# EAGLE schematic ver5b (EAGLE 6.4)
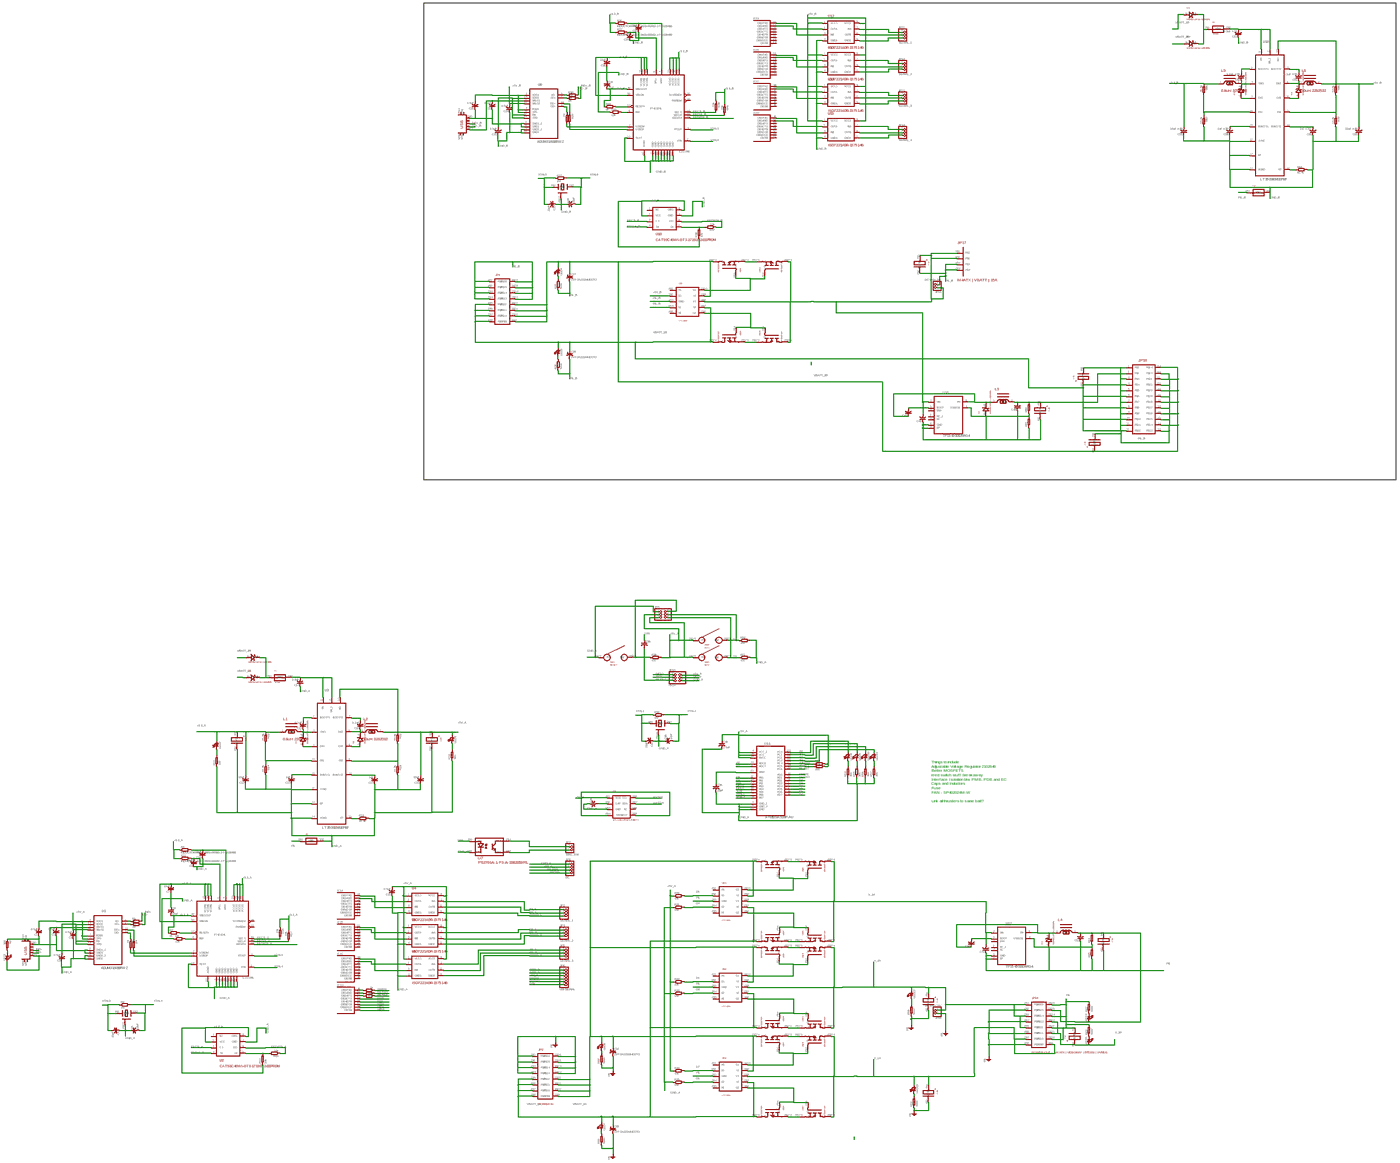
[diagram p0: schematic, sheet 1, overview]
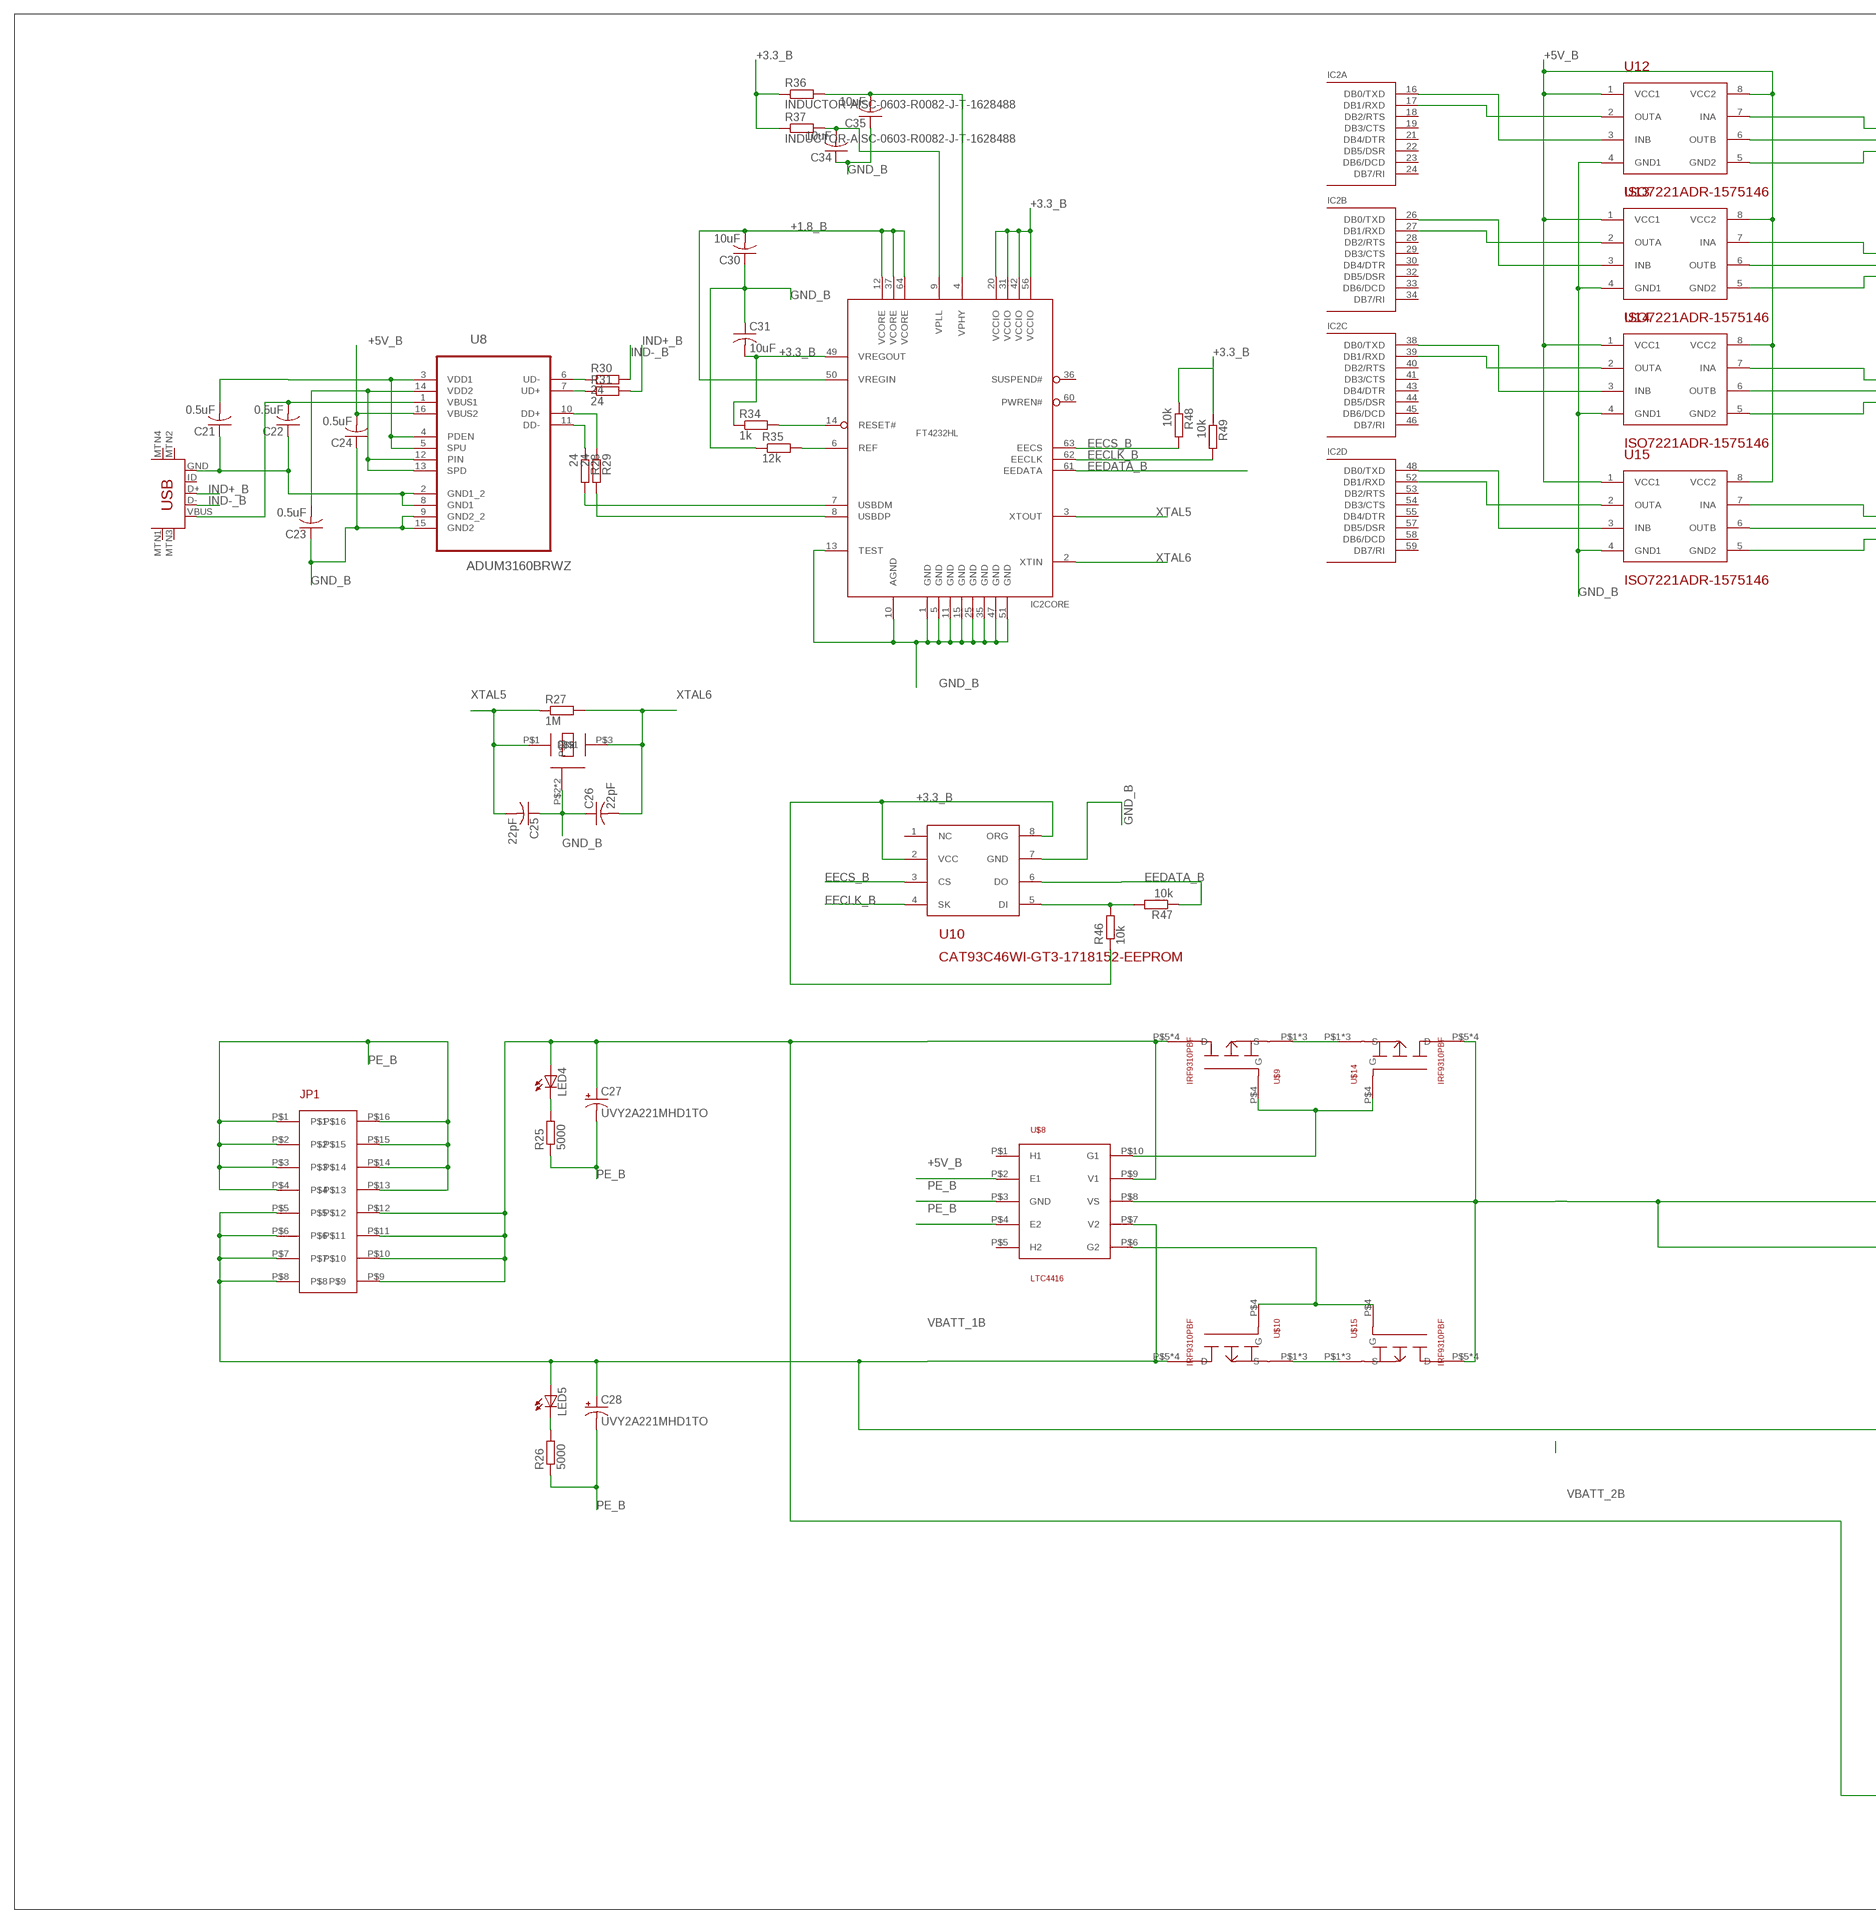
[diagram p1: schematic, sheet 1, part 1 of 6]
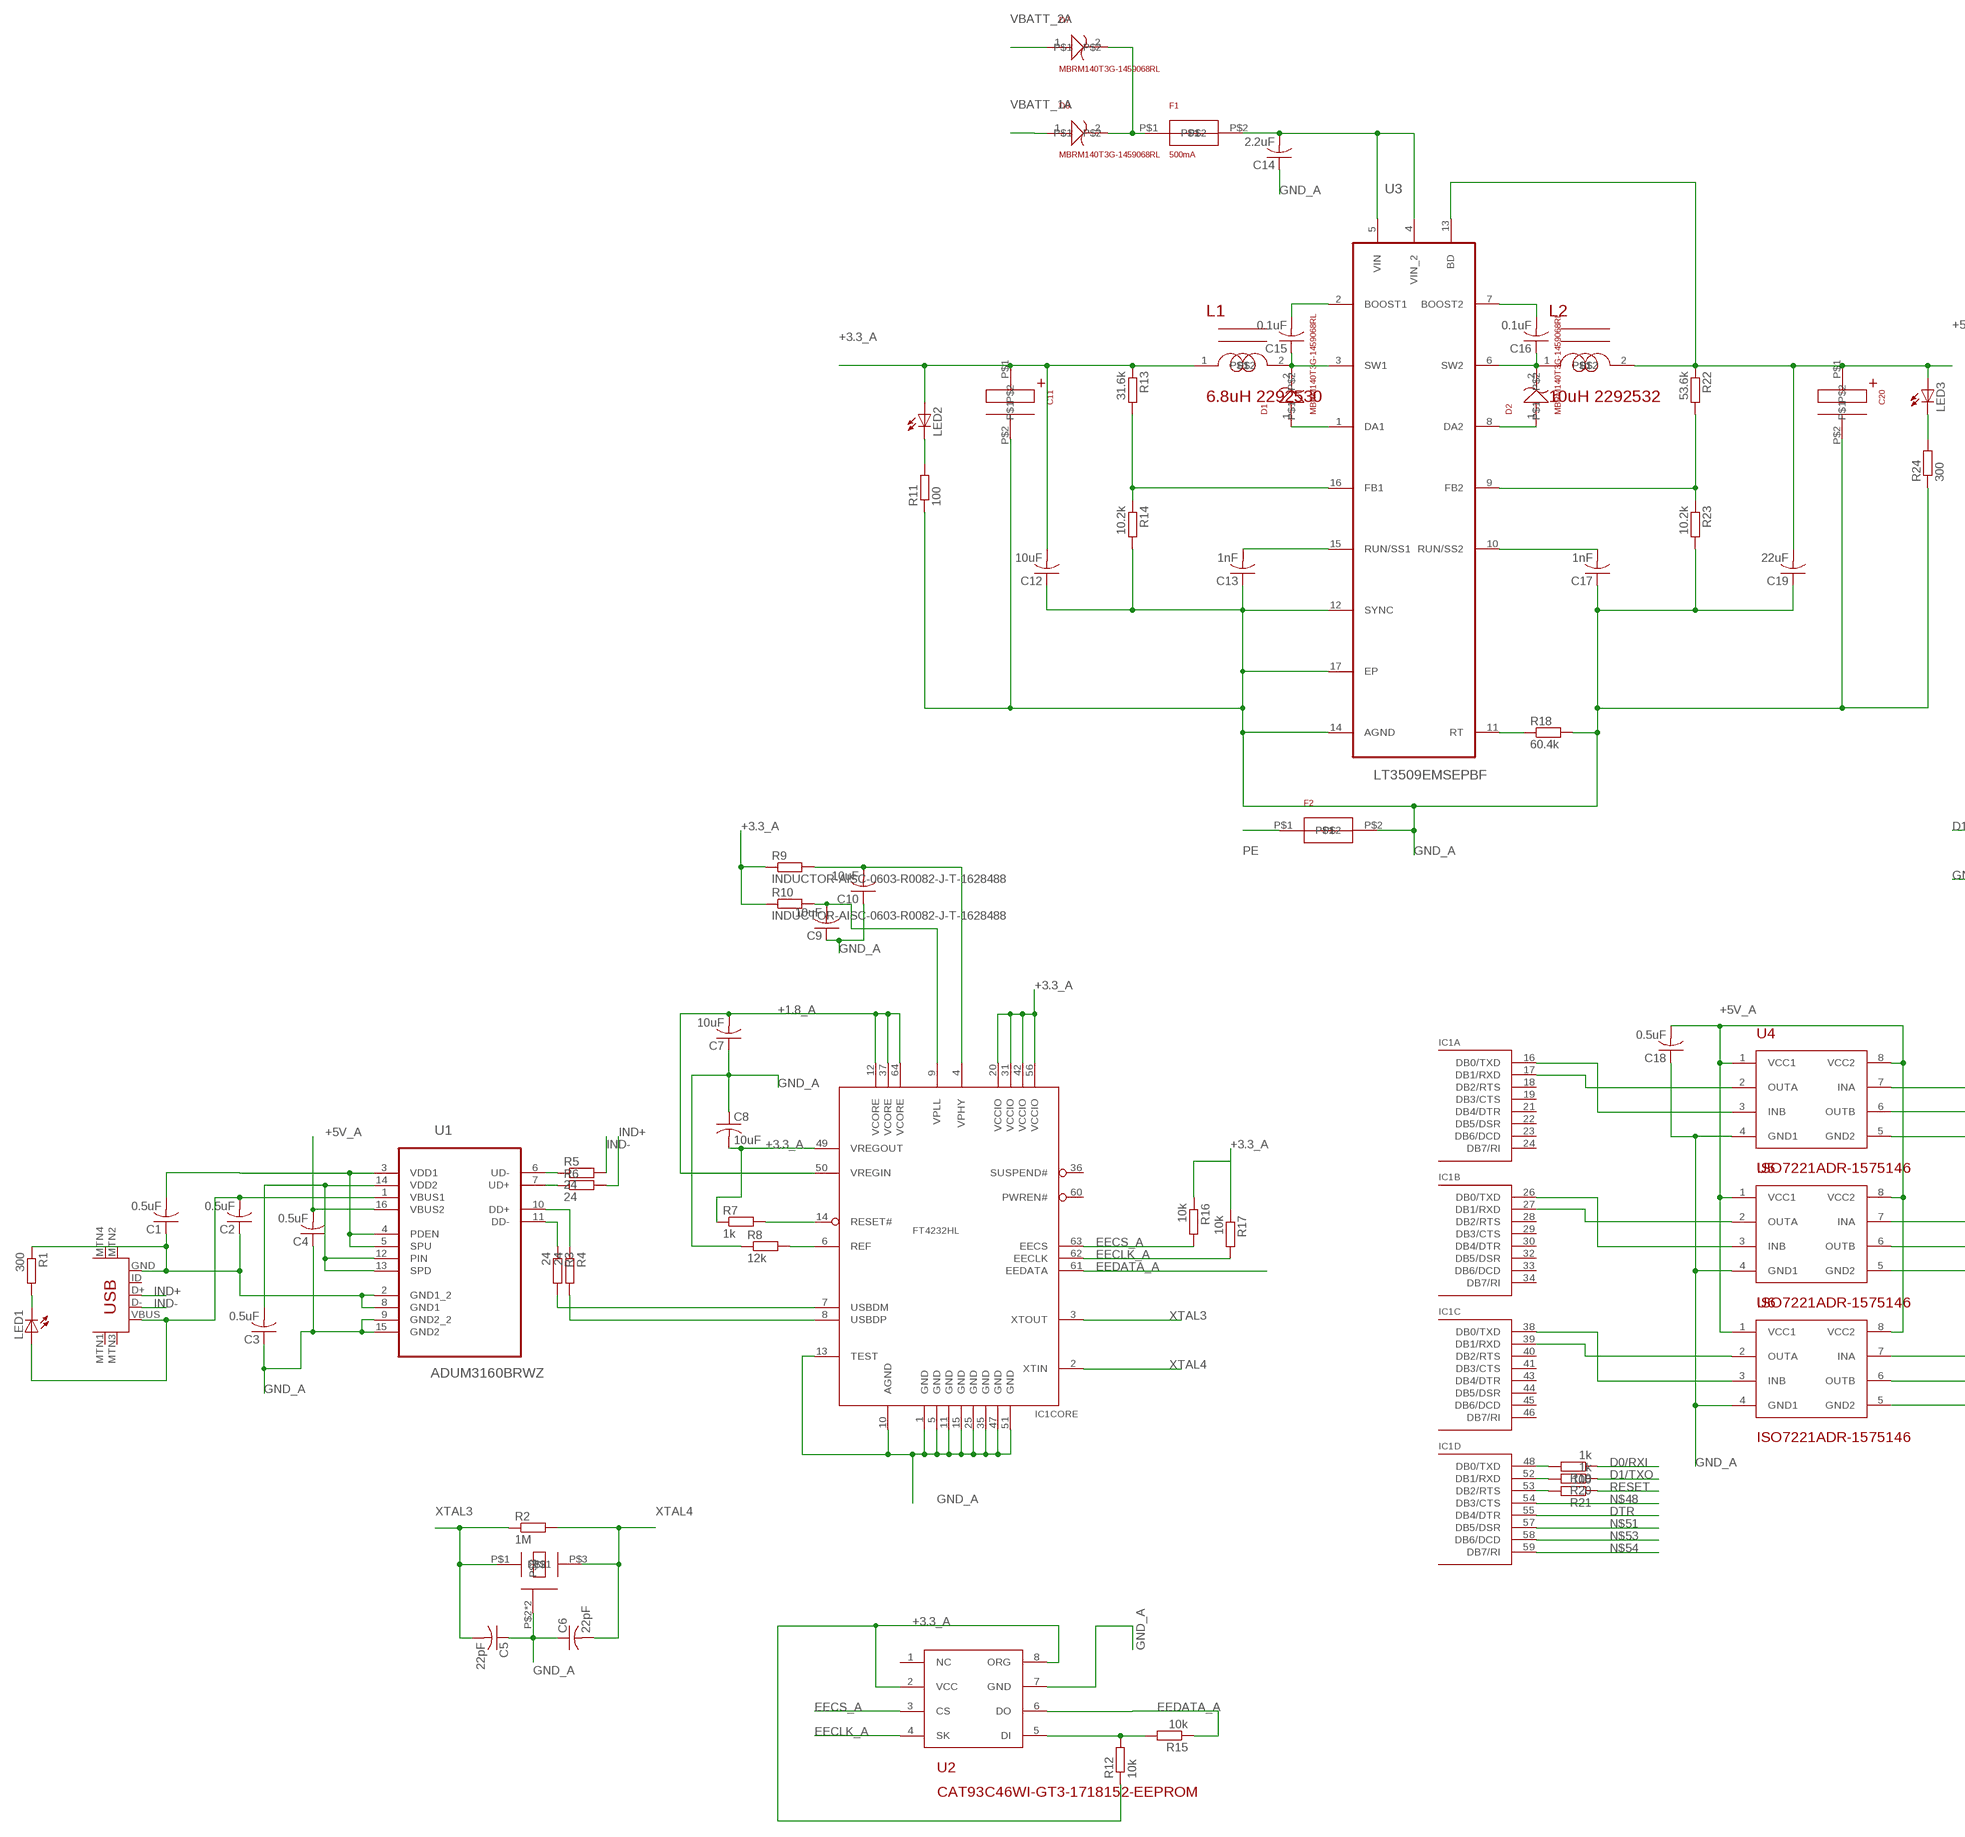
[diagram p2: schematic, sheet 1, part 2 of 6]
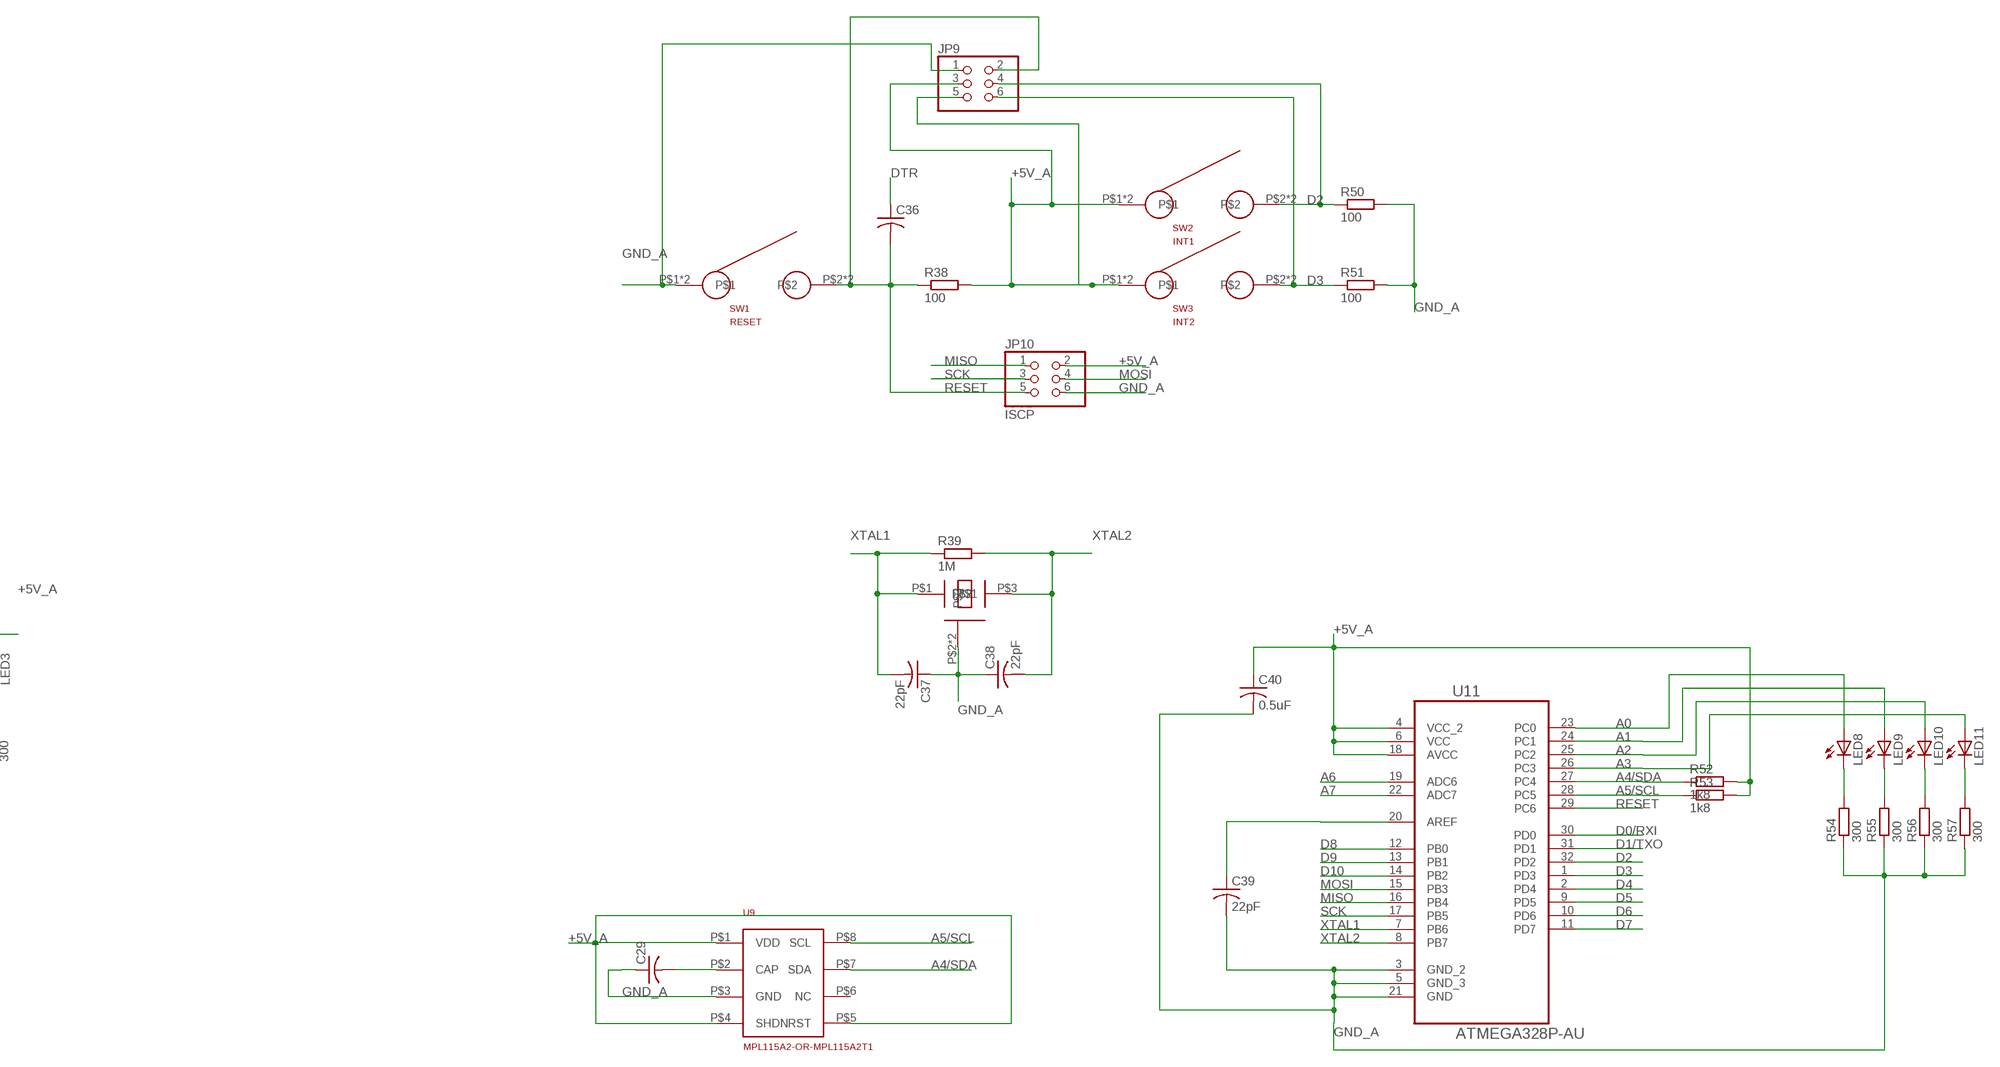
[diagram p3: schematic, sheet 1, part 3 of 6]
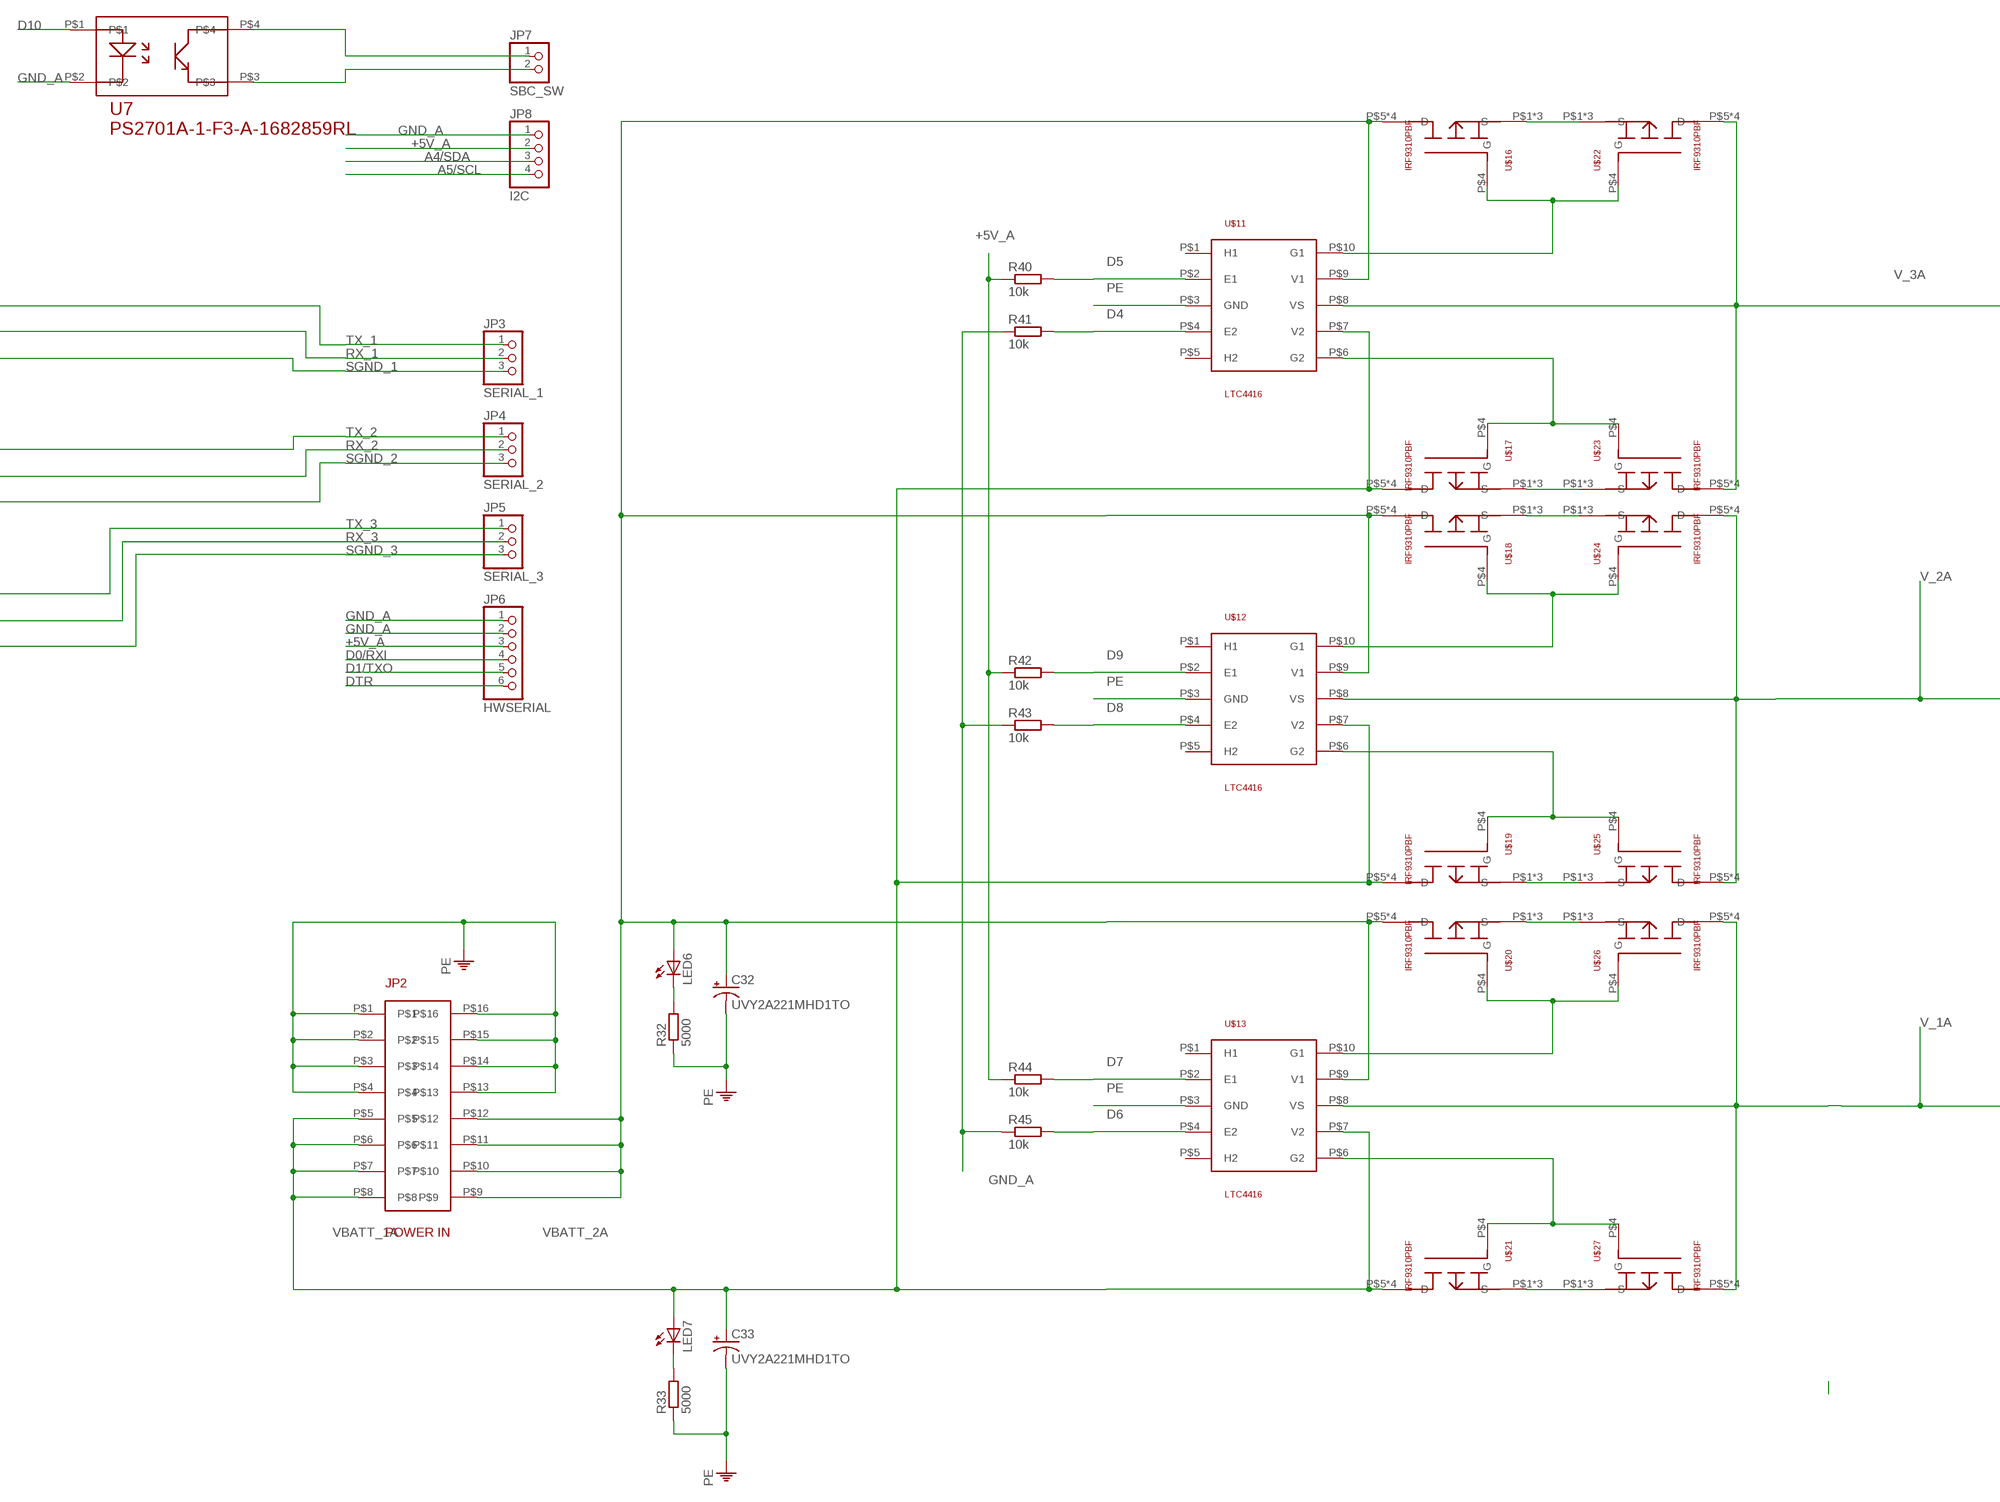
[diagram p4: schematic, sheet 1, part 4 of 6]
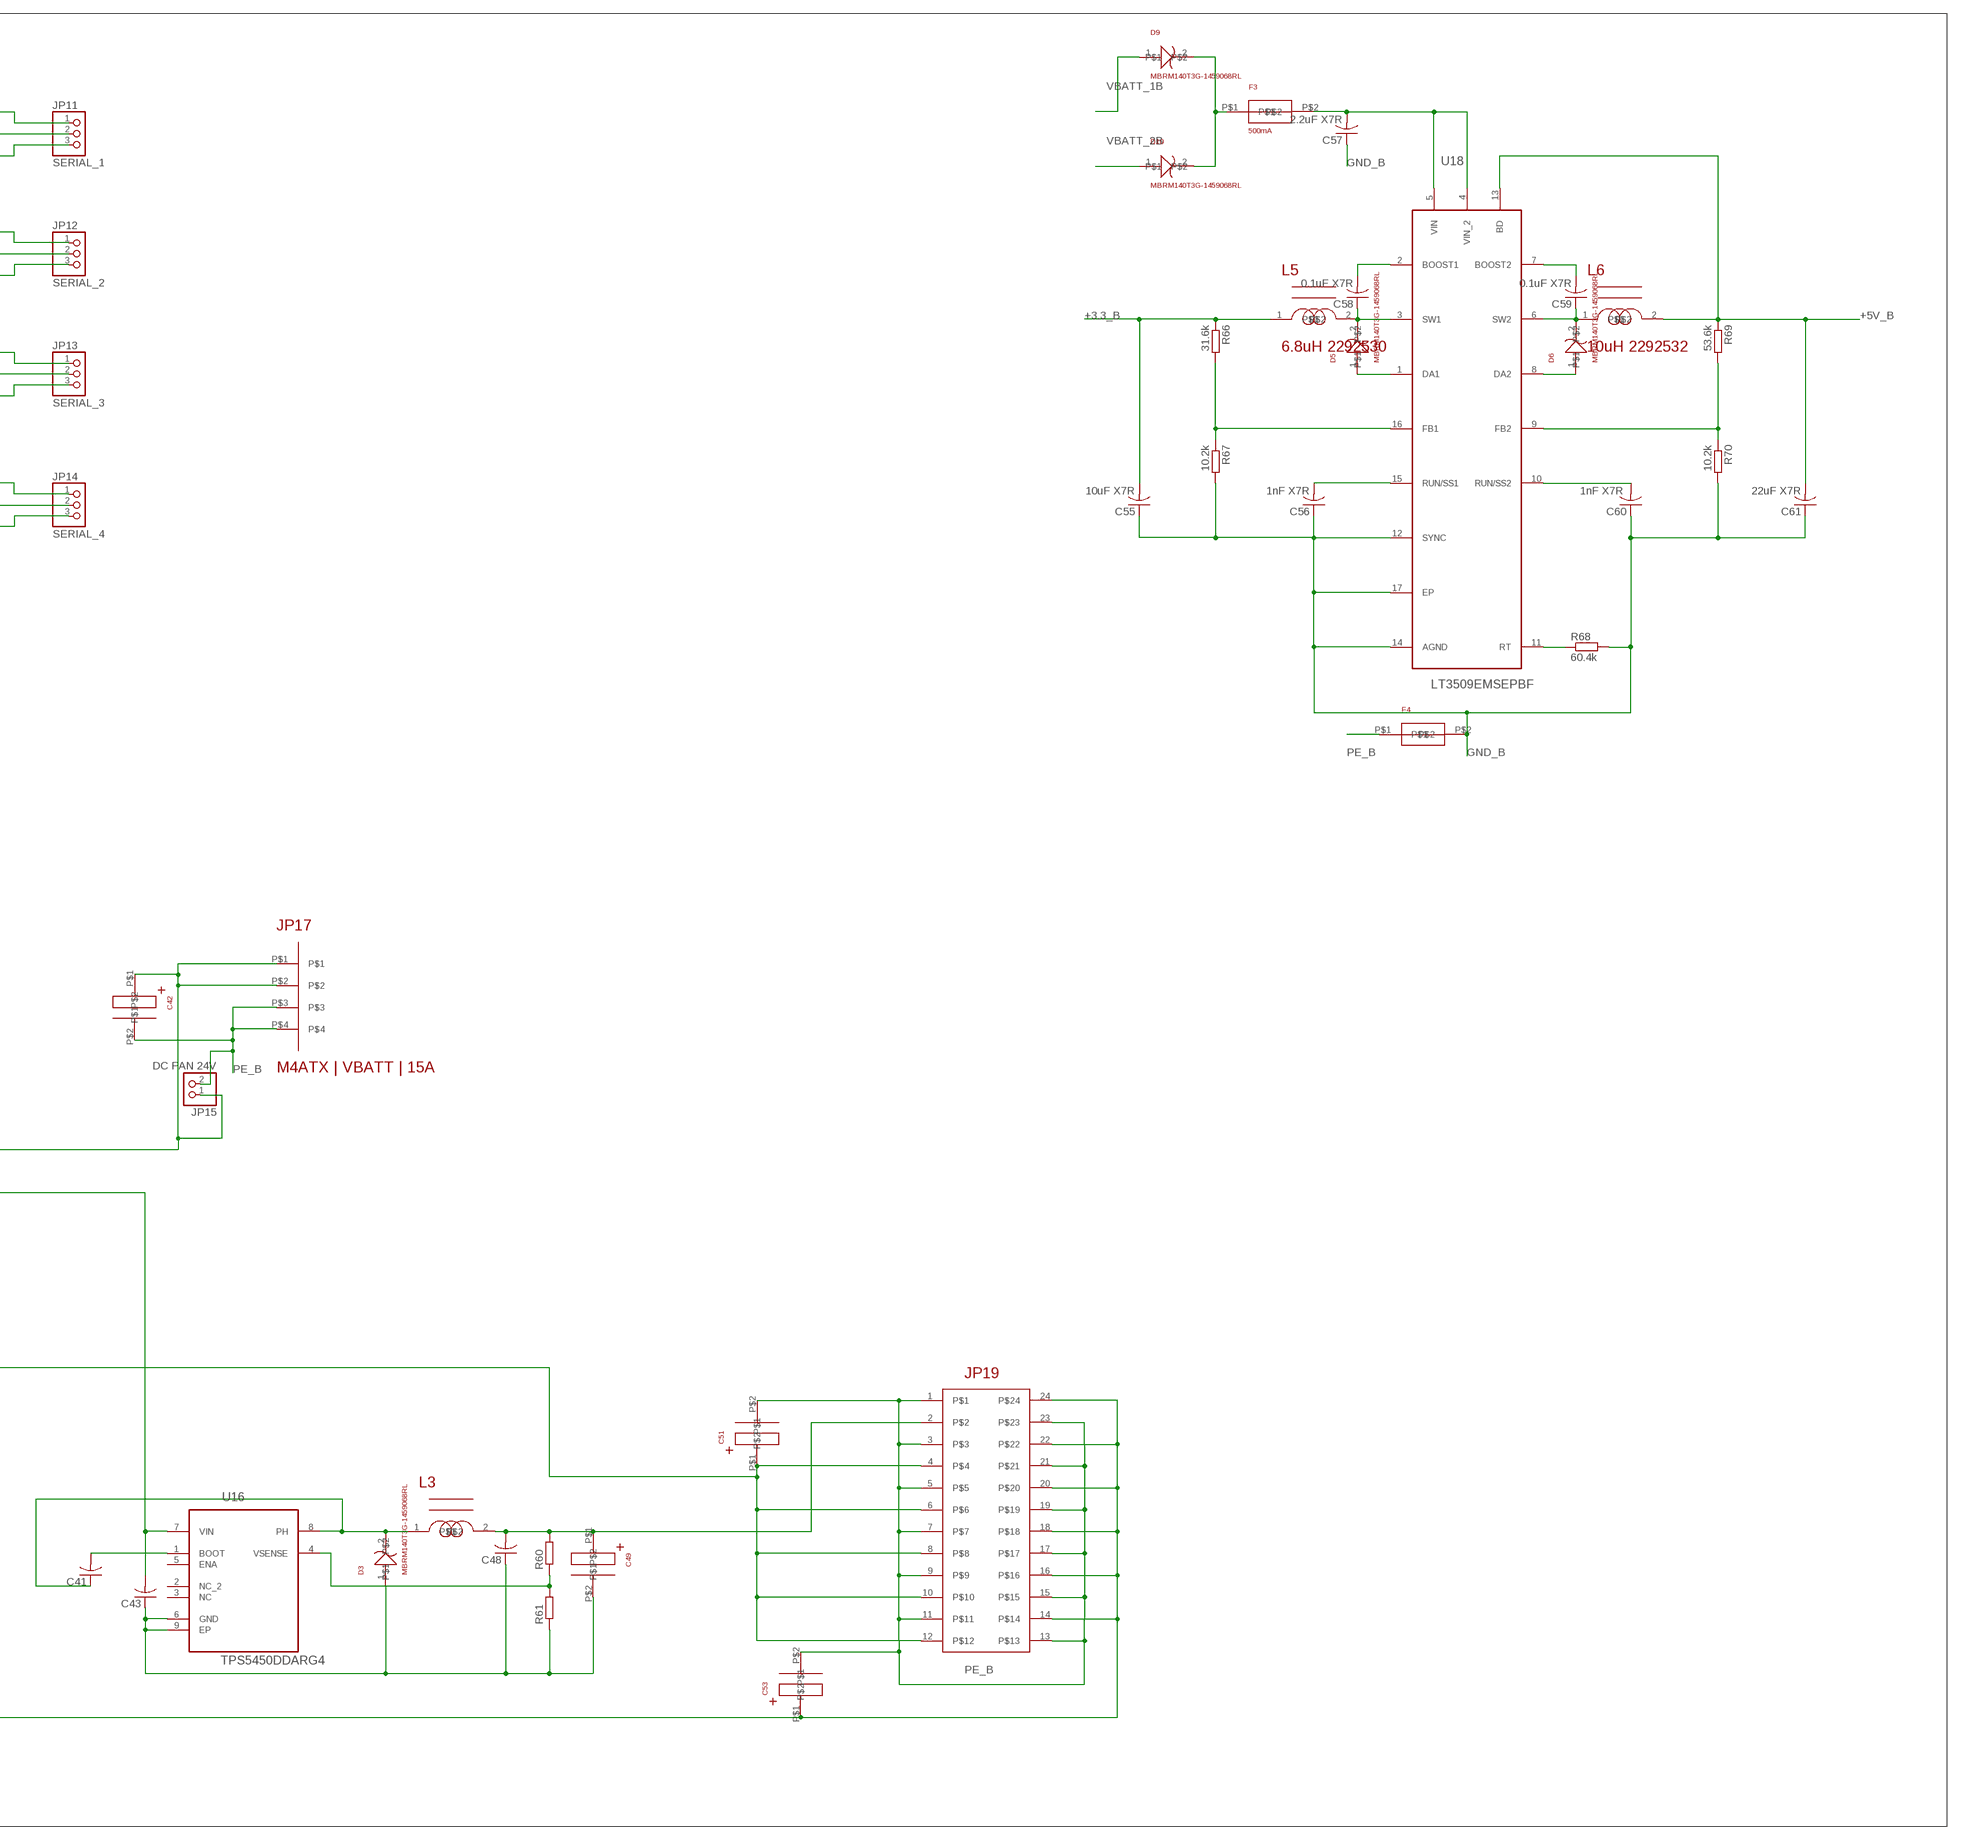
[diagram p5: schematic, sheet 1, part 5 of 6]
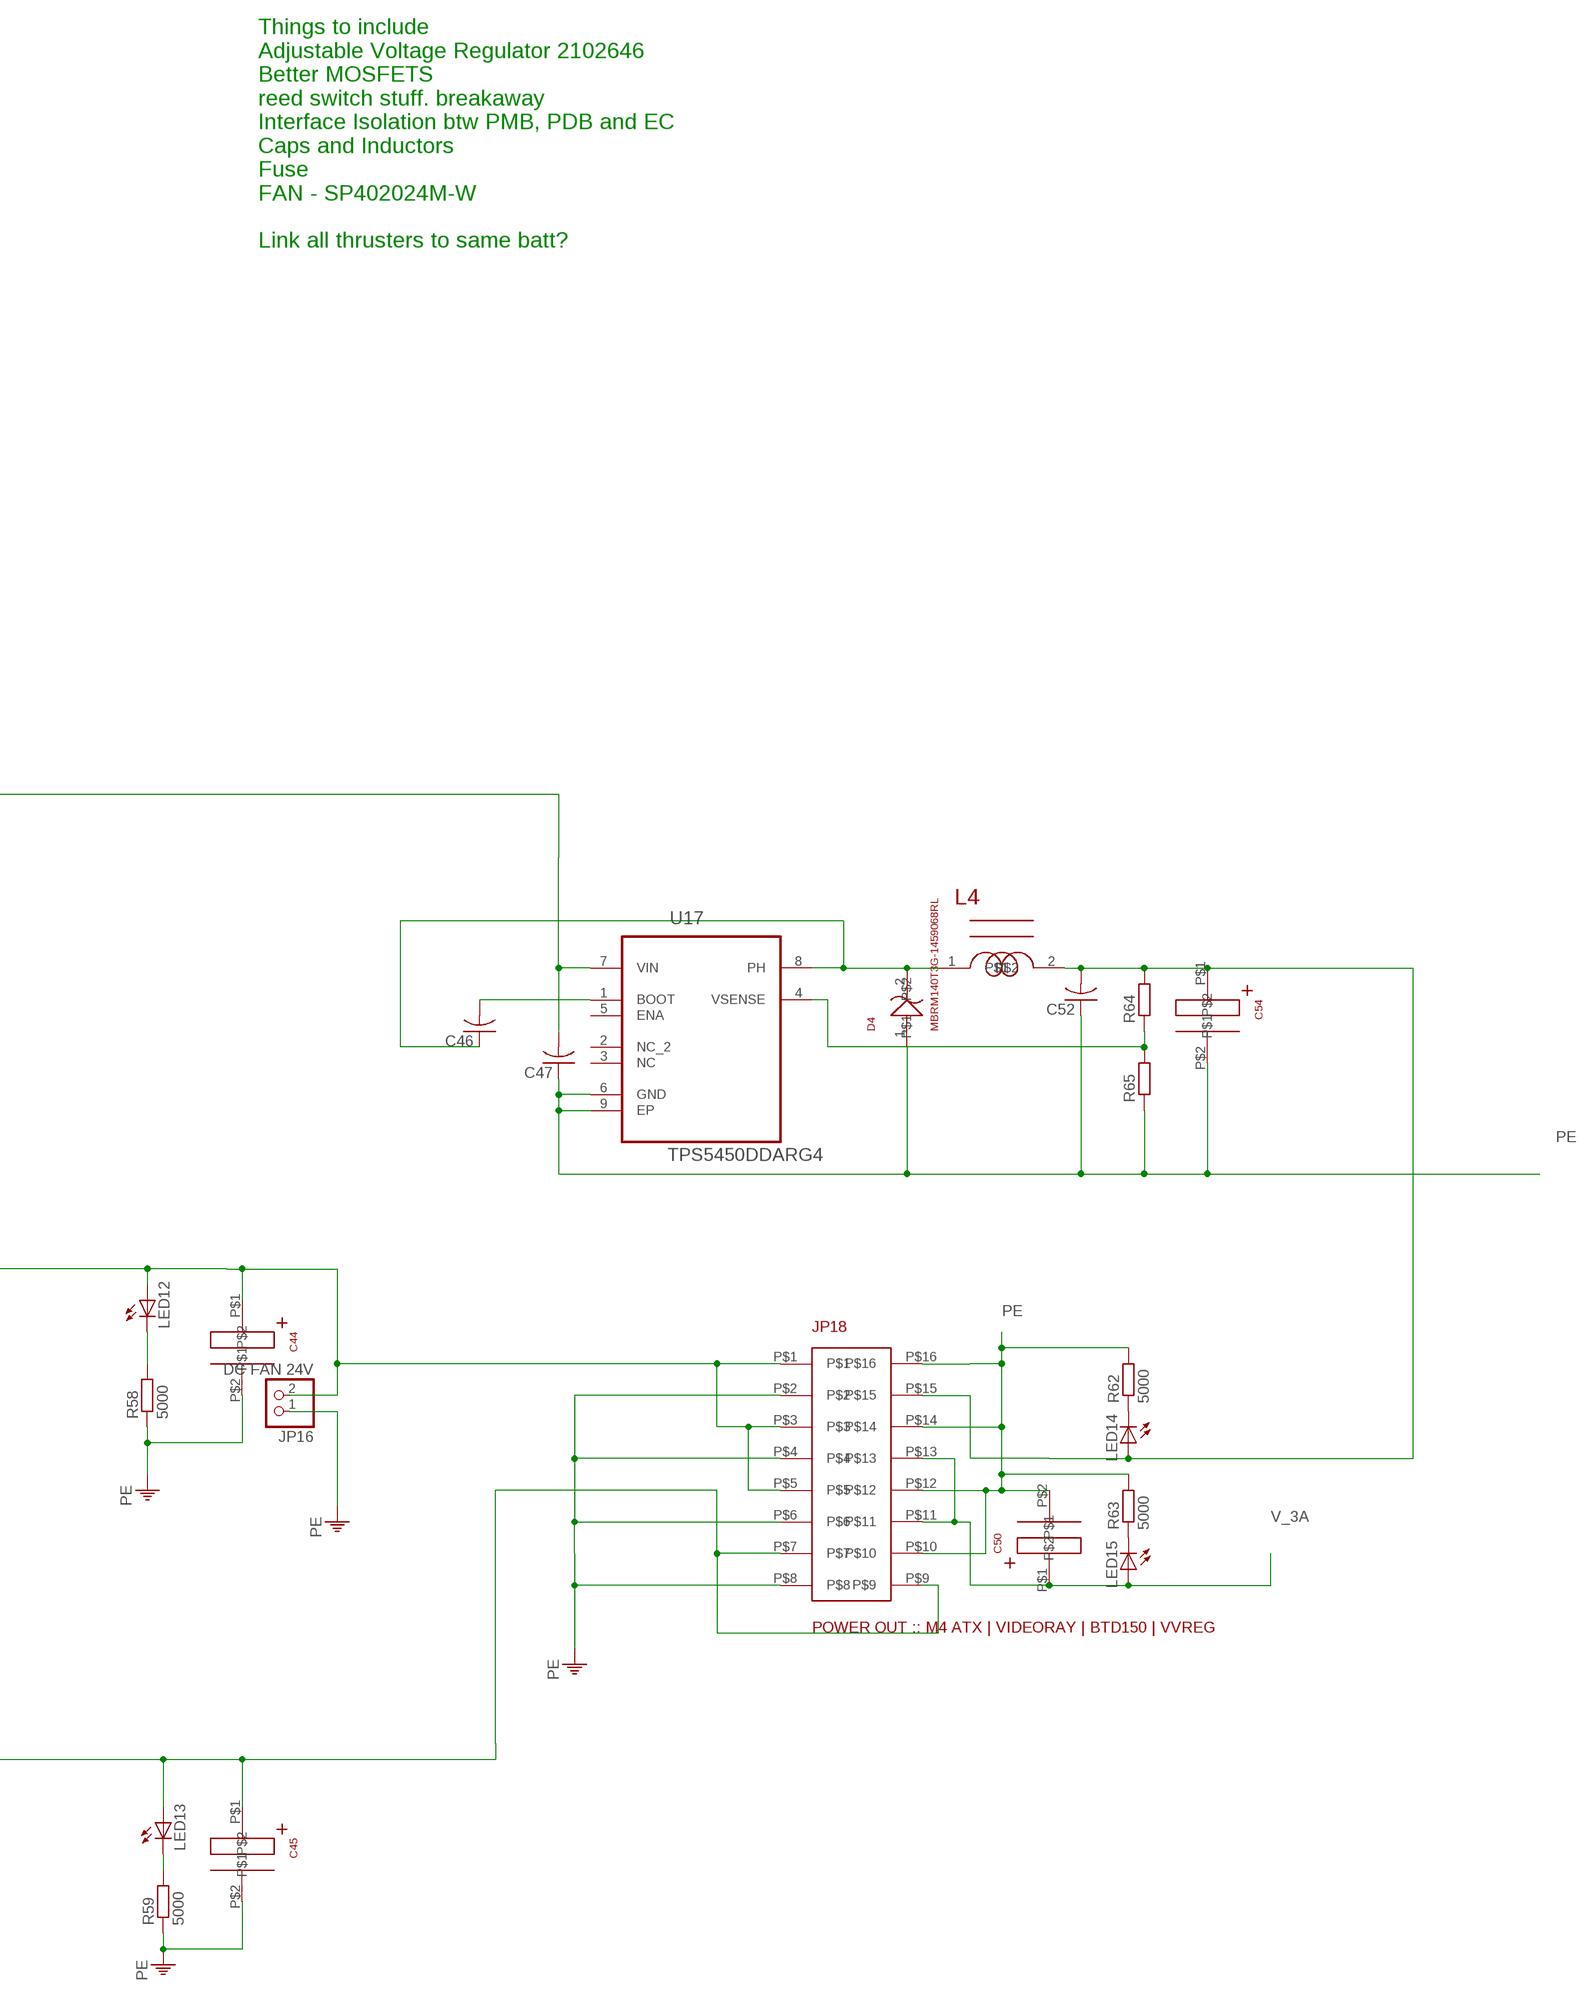
[diagram p6: schematic, sheet 1, part 6 of 6]

## Parts
C1  0.5uF  C-USC1206  [C1206]
C2  0.5uF  C-USC1206  [C1206]
C3  0.5uF  C-USC1206  [C1206]
C4  0.5uF  C-USC1206  [C1206]
C5  22pF  C-USC1206  [C1206]
C6  22pF  C-USC1206  [C1206]
C7  10uF  C-USC1206  [C1206]
C8  10uF  C-USC1206  [C1206]
C9  10uF  C-USC1206  [C1206]
C10  10uF  C-USC1206  [C1206]
C11  EEEFTH101XAP  [EEEFTH101XAP]
C12  10uF  C-USC1206  [C1206]
C13  1nF  C-USC1206  [C1206]
C14  2.2uF  C-USC1206  [C1206]
C15  0.1uF  C-USC1206  [C1206]
C16  0.1uF  C-USC1206  [C1206]
C17  1nF  C-USC1206  [C1206]
C18  0.5uF  C-USC1206  [C1206]
C19  22uF  C-USC1206  [C1206]
C20  EEEFTH101XAP  [EEEFTH101XAP]
C21  0.5uF  C-USC1206  [C1206]
C22  0.5uF  C-USC1206  [C1206]
C23  0.5uF  C-USC1206  [C1206]
C24  0.5uF  C-USC1206  [C1206]
C25  22pF  C-USC1206  [C1206]
C26  22pF  C-USC1206  [C1206]
C27  UVY2A221MHD1TO  CPOL-USE5-13  [E5-13]
C28  UVY2A221MHD1TO  CPOL-USE5-13  [E5-13]
C29  C-USC1206  [C1206]
C30  10uF  C-USC1206  [C1206]
C31  10uF  C-USC1206  [C1206]
C32  UVY2A221MHD1TO  CPOL-USE5-13  [E5-13]
C33  UVY2A221MHD1TO  CPOL-USE5-13  [E5-13]
C34  10uF  C-USC1206  [C1206]
C35  10uF  C-USC1206  [C1206]
C36  C-USC1206  [C1206]
C37  22pF  C-USC1206  [C1206]
C38  22pF  C-USC1206  [C1206]
C39  22pF  C-USC1206  [C1206]
C40  0.5uF  C-USC1206  [C1206]
C41  C-USC1206  [C1206]
C42  EEEFTH101XAP  [EEEFTH101XAP]
C43  C-USC1206  [C1206]
C44  EEEFTH101XAP  [EEEFTH101XAP]
C45  EEEFTH101XAP  [EEEFTH101XAP]
C46  C-USC1206  [C1206]
C47  C-USC1206  [C1206]
C48  C-USC1206  [C1206]
C49  EEEFTH101XAP  [EEEFTH101XAP]
C50  EEEFTH101XAP  [EEEFTH101XAP]
C51  EEEFTH101XAP  [EEEFTH101XAP]
C52  C-USC1206  [C1206]
C53  EEEFTH101XAP  [EEEFTH101XAP]
C54  EEEFTH101XAP  [EEEFTH101XAP]
C55  10uF X7R  C-USC1206  [C1206]
C56  1nF X7R  C-USC1206  [C1206]
C57  2.2uF X7R  C-USC1206  [C1206]
C58  0.1uF X7R  C-USC1206  [C1206]
C59  0.1uF X7R  C-USC1206  [C1206]
C60  1nF X7R  C-USC1206  [C1206]
C61  22uF X7R  C-USC1206  [C1206]
D1  MBRM140T3G-1459068RL  [MBRM140T3G-1459068RL]
D2  MBRM140T3G-1459068RL  [MBRM140T3G-1459068RL]
D3  MBRM140T3G-1459068RL  [MBRM140T3G-1459068RL]
D4  MBRM140T3G-1459068RL  [MBRM140T3G-1459068RL]
D5  MBRM140T3G-1459068RL  [MBRM140T3G-1459068RL]
D6  MBRM140T3G-1459068RL  [MBRM140T3G-1459068RL]
D7  MBRM140T3G-1459068RL  [MBRM140T3G-1459068RL]
D8  MBRM140T3G-1459068RL  [MBRM140T3G-1459068RL]
D9  MBRM140T3G-1459068RL  [MBRM140T3G-1459068RL]
D10  MBRM140T3G-1459068RL  [MBRM140T3G-1459068RL]
F1  500mA  MF-MSMF050-2  [MF-MSMF050-2]
F2  0154.500DR-FUSE-0453.500  [0154.500DR-FUSE-0453.500]
F3  500mA  MF-MSMF050-2  [MF-MSMF050-2]
F4  0154.500DR-FUSE-0453.500  [0154.500DR-FUSE-0453.500]
IC1  FT4232HL  [LQFP64]
IC2  FT4232HL  [LQFP64]
JP1  39-29-1167-MOLEX  [39-29-1167-MOLEX]
JP2  POWER IN  39-29-1167-MOLEX  [39-29-1167-MOLEX]
JP3  SERIAL_1  PINHD-1X3/90  [1X03/90]
JP4  SERIAL_2  PINHD-1X3/90  [1X03/90]
JP5  SERIAL_3  PINHD-1X3/90  [1X03/90]
JP6  HWSERIAL  PINHD-1X6  [1X06]
JP7  SBC_SW  PINHD-1X2  [1X02]
JP8  I2C  PINHD-1X4  [1X04]
JP9  PINHD-2X3  [2X03]
JP10  ISCP  PINHD-2X3  [2X03]
JP11  SERIAL_1  PINHD-1X3/90  [1X03/90]
JP12  SERIAL_2  PINHD-1X3/90  [1X03/90]
JP13  SERIAL_3  PINHD-1X3/90  [1X03/90]
JP14  SERIAL_4  PINHD-1X3/90  [1X03/90]
JP15  DC FAN 24V  PINHD-1X2  [1X02]
JP16  DC FAN 24V  PINHD-1X2  [1X02]
JP17  M4ATX | VBATT | 15A  39-29-4049-MOLEX  [39-29-4049-MOLEX]
JP18  POWER OUT :: M4 ATX | VIDEORAY | BTD150 | VVREG  39-29-1167-MOLEX  [39-29-1167-MOLEX]
JP19  43045-2400  [43045-2400]
L1  6.8uH 2292530  LAIRD-TECH-INDUCTOR-TYS5040  [LAIRD-TECH-INDUCTOR-TYS5040]
L2  10uH 2292532  LAIRD-TECH-INDUCTOR-TYS5040  [LAIRD-TECH-INDUCTOR-TYS5040]
L3  SER1360-802KLD-2288814RL-INDUCTOR  [SER1360-802KLD-2288814RL-INDUCTOR]
L4  SER1360-802KLD-2288814RL-INDUCTOR  [SER1360-802KLD-2288814RL-INDUCTOR]
L5  6.8uH 2292530  LAIRD-TECH-INDUCTOR-TYS5040  [LAIRD-TECH-INDUCTOR-TYS5040]
L6  10uH 2292532  LAIRD-TECH-INDUCTOR-TYS5040  [LAIRD-TECH-INDUCTOR-TYS5040]
LED1  LEDCHIPLED_1206  [CHIPLED_1206]
LED2  LEDCHIPLED_1206  [CHIPLED_1206]
LED3  LEDCHIPLED_1206  [CHIPLED_1206]
LED4  LEDCHIPLED_1206  [CHIPLED_1206]
LED5  LEDCHIPLED_1206  [CHIPLED_1206]
LED6  LEDCHIPLED_1206  [CHIPLED_1206]
LED7  LEDCHIPLED_1206  [CHIPLED_1206]
LED8  LEDCHIPLED_1206  [CHIPLED_1206]
LED9  LEDCHIPLED_1206  [CHIPLED_1206]
LED10  LEDCHIPLED_1206  [CHIPLED_1206]
LED11  LEDCHIPLED_1206  [CHIPLED_1206]
LED12  LEDCHIPLED_1206  [CHIPLED_1206]
LED13  LEDCHIPLED_1206  [CHIPLED_1206]
LED14  LEDCHIPLED_1206  [CHIPLED_1206]
LED15  LEDCHIPLED_1206  [CHIPLED_1206]
R1  300  R-EU_R1206  [R1206]
R2  1M  R-EU_R1206  [R1206]
R3  24  R-EU_R1206  [R1206]
R4  24  R-EU_R1206  [R1206]
R5  24  R-EU_R1206  [R1206]
R6  24  R-EU_R1206  [R1206]
R7  1k  R-EU_R1206  [R1206]
R8  12k  R-EU_R1206  [R1206]
R9  INDUCTOR-AISC-0603-R0082-J-T-1628488  R-EU_R0603  [R0603]
R10  INDUCTOR-AISC-0603-R0082-J-T-1628488  R-EU_R0603  [R0603]
R11  100  R-EU_R1206  [R1206]
R12  10k  R-EU_R1206  [R1206]
R13  31.6k  R-EU_R1206  [R1206]
R14  10.2k  R-EU_R1206  [R1206]
R15  10k  R-EU_R1206  [R1206]
R16  10k  R-EU_R1206  [R1206]
R17  10k  R-EU_R1206  [R1206]
R18  60.4k  R-EU_R1206  [R1206]
R19  1k  R-EU_R1206  [R1206]
R20  1k  R-EU_R1206  [R1206]
R21  100  R-EU_R1206  [R1206]
R22  53.6k  R-EU_R1206  [R1206]
R23  10.2k  R-EU_R1206  [R1206]
R24  300  R-EU_R1206  [R1206]
R25  5000  R-EU_R1206  [R1206]
R26  5000  R-EU_R1206  [R1206]
R27  1M  R-EU_R1206  [R1206]
R28  24  R-EU_R1206  [R1206]
R29  24  R-EU_R1206  [R1206]
R30  24  R-EU_R1206  [R1206]
R31  24  R-EU_R1206  [R1206]
R32  5000  R-EU_R1206  [R1206]
R33  5000  R-EU_R1206  [R1206]
R34  1k  R-EU_R1206  [R1206]
R35  12k  R-EU_R1206  [R1206]
R36  INDUCTOR-AISC-0603-R0082-J-T-1628488  R-EU_R0603  [R0603]
R37  INDUCTOR-AISC-0603-R0082-J-T-1628488  R-EU_R0603  [R0603]
R38  100  R-EU_R1206  [R1206]
R39  1M  R-EU_R1206  [R1206]
R40  10k  R-EU_R1206  [R1206]
R41  10k  R-EU_R1206  [R1206]
R42  10k  R-EU_R1206  [R1206]
R43  10k  R-EU_R1206  [R1206]
R44  10k  R-EU_R1206  [R1206]
R45  10k  R-EU_R1206  [R1206]
R46  10k  R-EU_R1206  [R1206]
R47  10k  R-EU_R1206  [R1206]
R48  10k  R-EU_R1206  [R1206]
R49  10k  R-EU_R1206  [R1206]
R50  100  R-EU_R1206  [R1206]
R51  100  R-EU_R1206  [R1206]
R52  1k8  R-EU_R1206  [R1206]
R53  1k8  R-EU_R1206  [R1206]
R54  300  R-EU_R1206  [R1206]
R55  300  R-EU_R1206  [R1206]
R56  300  R-EU_R1206  [R1206]
R57  300  R-EU_R1206  [R1206]
R58  5000  R-EU_R1206  [R1206]
R59  5000  R-EU_R1206  [R1206]
R60  R-EU_R1206  [R1206]
R61  R-EU_R1206  [R1206]
R62  5000  R-EU_R1206  [R1206]
R63  5000  R-EU_R1206  [R1206]
R64  R-EU_R1206  [R1206]
R65  R-EU_R1206  [R1206]
R66  31.6k  R-EU_R1206  [R1206]
R67  10.2k  R-EU_R1206  [R1206]
R68  60.4k  R-EU_R1206  [R1206]
R69  53.6k  R-EU_R1206  [R1206]
R70  10.2k  R-EU_R1206  [R1206]
SW1  RESET  MC32829  [MC32829]
SW2  INT1  MC32829  [MC32829]
SW3  INT2  MC32829  [MC32829]
U1  ADUM3160BRWZ  [SOIC127P1032X265-16N]
U2  CAT93C46WI-GT3-1718152-EEPROM  [SO08]
U3  LT3509EMSEPBF  [SOP50P490X110-17N]
U4  ISO7221ADR-1575146  TI-ISO7221  [SO08]
U5  ISO7221ADR-1575146  TI-ISO7221  [SO08]
U6  ISO7221ADR-1575146  TI-ISO7221  [SO08]
U7  PS2701A-1-F3-A-1682859RL  [PS2701A-1-F3-A-1682859RL]
U8  ADUM3160BRWZ  [SOIC127P1032X265-16N]
U9  MPL115A2-OR-MPL115A2T1  [MPL115A2-OR-MPL115A2T1]
U10  CAT93C46WI-GT3-1718152-EEPROM  [SO08]
U11  ATMEGA328P-AU  [QFP80P900X900X120-32N]
U12  ISO7221ADR-1575146  TI-ISO7221  [SO08]
U13  ISO7221ADR-1575146  TI-ISO7221  [SO08]
U14  ISO7221ADR-1575146  TI-ISO7221  [SO08]
U15  ISO7221ADR-1575146  TI-ISO7221  [SO08]
U16  TPS5450DDARG4  [SOIC127P600X170-9N]
U17  TPS5450DDARG4  [SOIC127P600X170-9N]
U18  LT3509EMSEPBF  [SOP50P490X110-17N]
U$1  USB-MINIB-5PIN  [USB-MINIB]
U$2  ABMM2-12.000MHZ-E2-T  ABMM2-16.000MHZ-E2-T  [ABMM2-16.000MHZ-E2-T]
U$5  USB-MINIB-5PIN  [USB-MINIB]
U$6  ABMM2-12.000MHZ-E2-T  ABMM2-16.000MHZ-E2-T  [ABMM2-16.000MHZ-E2-T]
U$7  ABMM2-16.000MHZ-E2-T  [ABMM2-16.000MHZ-E2-T]
U$8  LTC4416  [LTC4416]
U$9  IRF9310PBF  [IRF9310PBF]
U$10  IRF9310PBF  [IRF9310PBF]
U$11  LTC4416  [LTC4416]
U$12  LTC4416  [LTC4416]
U$13  LTC4416  [LTC4416]
U$14  IRF9310PBF  [IRF9310PBF]
U$15  IRF9310PBF  [IRF9310PBF]
U$16  IRF9310PBF  [IRF9310PBF]
U$17  IRF9310PBF  [IRF9310PBF]
U$18  IRF9310PBF  [IRF9310PBF]
U$19  IRF9310PBF  [IRF9310PBF]
U$20  IRF9310PBF  [IRF9310PBF]
U$21  IRF9310PBF  [IRF9310PBF]
U$22  IRF9310PBF  [IRF9310PBF]
U$23  IRF9310PBF  [IRF9310PBF]
U$24  IRF9310PBF  [IRF9310PBF]
U$25  IRF9310PBF  [IRF9310PBF]
U$26  IRF9310PBF  [IRF9310PBF]
U$27  IRF9310PBF  [IRF9310PBF]

## Nets
+1.8_A: C7.2 IC1.12(CORE:VCORE) IC1.37(CORE:VCORE) IC1.50(CORE:VREGIN) IC1.64(CORE:VCORE)
+1.8_B: C30.2 IC2.12(CORE:VCORE) IC2.37(CORE:VCORE) IC2.50(CORE:VREGIN) IC2.64(CORE:VCORE)
+3.3_A: C8.2 C11.P$1 C12.2 IC1.20(CORE:VCCIO) IC1.31(CORE:VCCIO) IC1.42(CORE:VCCIO) IC1.49(CORE:VREGOUT) IC1.56(CORE:VCCIO) L1.1 LED2.A R7.1 R9.1 R10.1 R12.1 R13.1 R16.1 R17.1 U2.2(VCC) U2.8(ORG)
+3.3_B: C31.2 C55.2 IC2.20(CORE:VCCIO) IC2.31(CORE:VCCIO) IC2.42(CORE:VCCIO) IC2.49(CORE:VREGOUT) IC2.56(CORE:VCCIO) L5.1 R34.1 R36.1 R37.1 R46.1 R48.1 R49.1 R66.1 U10.2(VCC) U10.8(ORG)
+5V_A: C4.2 C18.2 C19.2 C20.P$1 C40.1 JP6.3 JP8.2 JP9.3 JP9.5 JP10.2 L2.2 LED3.A R22.1 R38.2 R40.1 R42.1 R44.1 R52.2 R53.2 SW2.P$1 SW2.P$4 SW3.P$1 SW3.P$4 U1.16(VBUS2) U3.13(BD) U4.1(VCC1) U4.8(VCC2) U5.1(VCC1) U5.8(VCC2) U6.1(VCC1) U6.8(VCC2) U9.P$1(VDD) U9.P$4(SHDN) U9.P$5(RST) U11.4(VCC_2) U11.6(VCC) U11.18(AVCC)
+5V_B: C24.2 C61.2 L6.2 R69.1 U8.16(VBUS2) U12.1(VCC1) U12.8(VCC2) U13.1(VCC1) U13.8(VCC2) U14.1(VCC1) U14.8(VCC2) U15.1(VCC1) U15.8(VCC2) U18.13(BD) U$8.P$2(E1)
A0: LED8.A U11.23(PC0)
A1: LED9.A U11.24(PC1)
A2: LED10.A U11.25(PC2)
A3: LED11.A U11.26(PC3)
A4/SDA: JP8.3 R52.1 U9.P$7(SDA) U11.27(PC4)
A5/SCL: JP8.4 R53.1 U9.P$8(SCL) U11.28(PC5)
A6: U11.19(ADC6)
A7: U11.22(ADC7)
D0/RXI: JP6.4 R19.1 U11.30(PD0)
D1/TXO: JP6.5 R20.1 U11.31(PD1)
D2: JP9.4 R50.1 SW2.P$2 SW2.P$3 U11.32(PD2)
D3: JP9.6 R51.1 SW3.P$2 SW3.P$3 U11.1(PD3)
D4: R41.2 U11.2(PD4) U$11.P$4(E2)
D5: R40.2 U11.9(PD5) U$11.P$2(E1)
D6: R45.2 U11.10(PD6) U$13.P$4(E2)
D7: R44.2 U11.11(PD7) U$13.P$2(E1)
D8: R43.2 U11.12(PB0) U$12.P$4(E2)
D9: R42.2 U11.13(PB1) U$12.P$2(E1)
D10: U7.P$1 U11.14(PB2)
DTR: C36.1 IC1.55(D:DB4/DTR) JP6.6
EECLK_A: IC1.62(CORE:EECLK) R17.2 U2.4(SK)
EECLK_B: IC2.62(CORE:EECLK) R49.2 U10.4(SK)
EECS_A: IC1.63(CORE:EECS) R16.2 U2.3(CS)
EECS_B: IC2.63(CORE:EECS) R48.2 U10.3(CS)
EEDATA_A: IC1.61(CORE:EEDATA) R15.1 U2.6(DO)
EEDATA_B: IC2.61(CORE:EEDATA) R47.1 U10.6(DO)
GND_A: C3.1 C4.1 C5.1 C6.1 C7.1 C8.1 C9.1 C10.1 C11.P$2 C12.1 C13.1 C14.1 C17.1 C18.1 C19.1 C20.P$2 C29.1 C37.1 C38.1 C39.2 C40.2 F2.P$2 IC1.1(CORE:GND) IC1.5(CORE:GND) IC1.10(CORE:AGND) IC1.11(CORE:GND) IC1.13(CORE:TEST) IC1.15(CORE:GND) IC1.25(CORE:GND) IC1.35(CORE:GND) IC1.47(CORE:GND) IC1.51(CORE:GND) JP6.1 JP6.2 JP8.1 JP9.1 JP10.6 R8.1 R11.1 R14.2 R18.2 R23.2 R24.1 R41.1 R43.1 R45.1 R50.2 R51.2 R54.1 R55.1 R56.1 R57.1 SW1.P$1 SW1.P$4 U1.9(GND2_2) U1.15(GND2) U2.7(GND) U3.12(SYNC) U3.14(AGND) U3.17(EP) U4.4(GND1) U5.4(GND1) U6.4(GND1) U7.P$2 U9.P$3(GND) U11.3(GND_2) U11.5(GND_3) U11.21(GND) U$2.P$2 U$2.P$4 U$7.P$2 U$7.P$4
GND_B: C23.1 C24.1 C25.1 C26.1 C30.1 C31.1 C34.1 C35.1 C55.1 C56.1 C57.1 C60.1 C61.1 F4.P$2 IC2.1(CORE:GND) IC2.5(CORE:GND) IC2.10(CORE:AGND) IC2.11(CORE:GND) IC2.13(CORE:TEST) IC2.15(CORE:GND) IC2.25(CORE:GND) IC2.35(CORE:GND) IC2.47(CORE:GND) IC2.51(CORE:GND) R35.1 R67.2 R68.2 R70.2 U8.9(GND2_2) U8.15(GND2) U10.7(GND) U12.4(GND1) U13.4(GND1) U14.4(GND1) U15.4(GND1) U18.12(SYNC) U18.14(AGND) U18.17(EP) U$6.P$2 U$6.P$4
IND+: R6.2 U$1.D+
IND+_B: R31.2 U$5.D+
IND-: R5.2 U$1.D-
IND-_B: R30.2 U$5.D-
MISO: JP10.1 U11.16(PB4)
MOSI: JP10.4 U11.15(PB3)
N$1: U$20.P$1(S) U$20.P$2(S) U$20.P$3(S) U$26.P$1(S) U$26.P$2(S) U$26.P$3(S)
N$2: U$21.P$1(S) U$21.P$2(S) U$21.P$3(S) U$27.P$1(S) U$27.P$2(S) U$27.P$3(S)
N$3: U$13.P$10(G1) U$20.P$4(G) U$26.P$4(G)
N$4: U$13.P$6(G2) U$21.P$4(G) U$27.P$4(G)
N$5: C57.2 F3.P$2 U18.4(VIN_2) U18.5(VIN)
N$6: C58.1 D5.2 L5.2 U18.3(SW1)
N$7: D9.2 D10.2 F3.P$1
N$8: LED6.C R32.2
N$9: LED8.C R54.2
N$10: LED14.C R62.1
N$11: LED7.C R33.2
N$12: U$18.P$1(S) U$18.P$2(S) U$18.P$3(S) U$24.P$1(S) U$24.P$2(S) U$24.P$3(S)
N$13: U$19.P$1(S) U$19.P$2(S) U$19.P$3(S) U$25.P$1(S) U$25.P$2(S) U$25.P$3(S)
N$14: U$12.P$10(G1) U$18.P$4(G) U$24.P$4(G)
N$15: U$12.P$6(G2) U$19.P$4(G) U$25.P$4(G)
N$16: C59.1 D6.2 L6.1 U18.6(SW2)
N$17: U$9.P$1(S) U$9.P$2(S) U$9.P$3(S) U$14.P$1(S) U$14.P$2(S) U$14.P$3(S)
N$18: R68.1 U18.11(RT)
N$19: U$16.P$1(S) U$16.P$2(S) U$16.P$3(S) U$22.P$1(S) U$22.P$2(S) U$22.P$3(S)
N$20: U$17.P$1(S) U$17.P$2(S) U$17.P$3(S) U$23.P$1(S) U$23.P$2(S) U$23.P$3(S)
N$21: U$11.P$10(G1) U$16.P$4(G) U$22.P$4(G)
N$22: U$11.P$6(G2) U$17.P$4(G) U$23.P$4(G)
N$23: LED9.C R55.2
N$24: LED10.C R56.2
N$25: LED11.C R57.2
N$26: C56.2 U18.15(RUN/SS1)
N$28: C60.2 U18.10(RUN/SS2)
N$29: C29.2 U9.P$2(CAP)
N$31: C14.2 F1.P$2 U3.4(VIN_2) U3.5(VIN)
N$32: R69.2 R70.1 U18.9(FB2)
N$33: R66.2 R67.1 U18.16(FB1)
N$34: C15.1 D1.2 L1.2 U3.3(SW1)
N$35: D5.1 U18.1(DA1)
N$36: C58.2 U18.2(BOOST1)
N$37: C59.2 U18.7(BOOST2)
N$38: IC1.53(D:DB2/RTS) R21.2
N$39: D6.1 U18.8(DA2)
N$40: C16.1 D2.2 L2.1 U3.6(SW2)
N$41: U$10.P$1(S) U$10.P$2(S) U$10.P$3(S) U$15.P$1(S) U$15.P$2(S) U$15.P$3(S)
N$42: U$8.P$10(G1) U$9.P$4(G) U$14.P$4(G)
N$43: U$8.P$6(G2) U$10.P$4(G) U$15.P$4(G)
N$44: LED4.C R25.2
N$45: LED5.C R26.2
N$46: IC1.52(D:DB1/RXD) R20.2
N$47: IC1.48(D:DB0/TXD) R19.2
N$48: IC1.54(D:DB3/CTS)
N$49: C21.2 U8.3(VDD1) U8.4(PDEN) U8.5(SPU)
N$50: LED13.C R59.2
N$51: IC1.57(D:DB5/DSR)
N$52: LED12.C R58.2
N$53: IC1.58(D:DB6/DCD)
N$54: IC1.59(D:DB7/RI)
N$55: C13.2 U3.15(RUN/SS1)
N$56: D7.2 D8.2 F1.P$1
N$57: JP7.2 U7.P$3
N$60: C17.2 U3.10(RUN/SS2)
N$61: R22.2 R23.1 U3.9(FB2)
N$62: R13.2 R14.1 U3.16(FB1)
N$63: D1.1 U3.1(DA1)
N$64: C15.2 U3.2(BOOST1)
N$65: C16.2 U3.7(BOOST2)
N$66: D2.1 U3.8(DA2)
N$67: R18.1 U3.11(RT)
N$68: C1.1 C2.1 R1.1 U1.2(GND1_2) U1.8(GND1) U$1.GND
N$69: C3.2 U1.12(PIN) U1.13(SPD) U1.14(VDD2)
N$70: R3.1 U1.11(DD-)
N$71: C1.2 U1.3(VDD1) U1.4(PDEN) U1.5(SPU)
N$72: C2.2 LED1.A U1.1(VBUS1) U$1.VBUS
N$73: R4.1 U1.10(DD+)
N$74: IC1.8(CORE:USBDP) R4.2
N$75: IC1.7(CORE:USBDM) R3.2
N$76: R5.1 U1.6(UD-)
N$77: R6.1 U1.7(UD+)
N$78: IC1.6(CORE:REF) R8.2
N$79: C10.2 IC1.4(CORE:VPHY) R9.2
N$80: C9.2 IC1.9(CORE:VPLL) R10.2
N$81: IC1.14(CORE:RESET#) R7.2
N$82: C22.2 U8.1(VBUS1) U$5.VBUS
N$83: C21.1 C22.1 U8.2(GND1_2) U8.8(GND1) U$5.GND
N$84: R12.2 R15.2 U2.5(DI)
N$85: C39.1 U11.20(AREF)
N$86: C23.2 U8.12(PIN) U8.13(SPD) U8.14(VDD2)
N$87: IC2.8(CORE:USBDP) R29.2
N$88: IC2.7(CORE:USBDM) R28.2
N$89: R28.1 U8.11(DD-)
N$90: R29.1 U8.10(DD+)
N$91: R30.1 U8.6(UD-)
N$92: R31.1 U8.7(UD+)
N$93: IC2.16(A:DB0/TXD) U12.3(INB)
N$94: IC2.17(A:DB1/RXD) U12.2(OUTA)
N$95: JP11.1 U12.7(INA)
N$96: IC2.26(B:DB0/TXD) U13.3(INB)
N$97: JP11.2 U12.6(OUTB)
N$98: IC1.16(A:DB0/TXD) U4.3(INB)
N$99: IC2.27(B:DB1/RXD) U13.2(OUTA)
N$100: IC2.38(C:DB0/TXD) U14.3(INB)
N$101: IC2.39(C:DB1/RXD) U14.2(OUTA)
N$102: IC2.48(D:DB0/TXD) U15.3(INB)
N$103: JP11.3 U12.5(GND2)
N$104: JP12.1 U13.7(INA)
N$105: JP12.2 U13.6(OUTB)
N$106: R46.2 R47.2 U10.5(DI)
N$107: C35.2 IC2.4(CORE:VPHY) R36.2
N$108: C34.2 IC2.9(CORE:VPLL) R37.2
N$109: IC2.6(CORE:REF) R35.2
N$110: IC2.14(CORE:RESET#) R34.2
N$111: JP12.3 U13.5(GND2)
N$112: JP13.1 U14.7(INA)
N$113: JP13.2 U14.6(OUTB)
N$114: JP13.3 U14.5(GND2)
N$115: JP14.1 U15.7(INA)
N$116: JP14.2 U15.6(OUTB)
N$117: JP14.3 U15.5(GND2)
N$118: IC2.52(D:DB1/RXD) U15.2(OUTA)
N$119: IC1.17(A:DB1/RXD) U4.2(OUTA)
N$120: IC1.26(B:DB0/TXD) U5.3(INB)
N$121: IC1.27(B:DB1/RXD) U5.2(OUTA)
N$122: IC1.38(C:DB0/TXD) U6.3(INB)
N$123: IC1.39(C:DB1/RXD) U6.2(OUTA)
N$124: C52.2 C54.P$1 JP18.P$15 L4.2 LED14.A R64.2
N$125: LED15.C R63.1
N$126: JP7.1 U7.P$4
N$127: C46.2 U17.1(BOOT)
N$128: C46.1 D4.2 L4.1 U17.8(PH)
N$129: C41.2 U16.1(BOOT)
N$130: C41.1 D3.2 L3.1 U16.8(PH)
N$131: C48.2 C49.P$1 JP19.2 L3.2 R60.2
N$132: R60.1 R61.2 U16.4(VSENSE)
N$133: LED3.C R24.2
N$134: R64.1 R65.2 U17.4(VSENSE)
N$135: LED1.C R1.2
N$136: LED2.C R11.2
N$137: C42.P$1 C43.2 JP15.1 JP17.P$1 JP17.P$2 U16.7(VIN) U$8.P$8(VS) U$14.P$5(D) U$14.P$6(D) U$14.P$7(D) U$14.P$8(D) U$15.P$5(D) U$15.P$6(D) U$15.P$7(D) U$15.P$8(D)
PE: C32.- C33.- C44.P$2 C45.P$2 C47.1 C50.P$2 C52.1 C54.P$2 D4.1 F2.P$1 JP2.P$1 JP2.P$2 JP2.P$3 JP2.P$4 JP2.P$13 JP2.P$14 JP2.P$15 JP2.P$16 JP16.1 JP18.P$2 JP18.P$4 JP18.P$6 JP18.P$8 JP18.P$10 JP18.P$12 JP18.P$14 JP18.P$16 R32.1 R33.1 R58.1 R59.1 R62.2 R63.2 R65.1 U17.6(GND) U17.9(EP) U$11.P$3(GND) U$12.P$3(GND) U$13.P$3(GND)
PE_B: C27.- C28.- C42.P$2 C43.1 C48.1 C49.P$2 C51.P$2 C53.P$2 D3.1 F4.P$1 JP1.P$1 JP1.P$2 JP1.P$3 JP1.P$4 JP1.P$13 JP1.P$14 JP1.P$15 JP1.P$16 JP15.2 JP17.P$3 JP17.P$4 JP19.1 JP19.3 JP19.5 JP19.7 JP19.9 JP19.11 JP19.13 JP19.15 JP19.17 JP19.19 JP19.21 JP19.23 R25.1 R26.1 R61.1 U16.6(GND) U16.9(EP) U$8.P$3(GND) U$8.P$4(E2)
RESET: C36.2 JP9.2 JP10.5 R21.1 R38.1 SW1.P$2 SW1.P$3 U11.29(PC6)
RX_1: JP3.2 U4.6(OUTB)
RX_2: JP4.2 U5.6(OUTB)
RX_3: JP5.2 U6.6(OUTB)
SCK: JP10.3 U11.17(PB5)
SGND_1: JP3.3 U4.5(GND2)
SGND_2: JP4.3 U5.5(GND2)
SGND_3: JP5.3 U6.5(GND2)
TX_1: JP3.1 U4.7(INA)
TX_2: JP4.1 U5.7(INA)
TX_3: JP5.1 U6.7(INA)
V_1A: C45.P$1 JP18.P$7 JP18.P$9 LED13.A U$13.P$8(VS) U$26.P$5(D) U$26.P$6(D) U$26.P$7(D) U$26.P$8(D) U$27.P$5(D) U$27.P$6(D) U$27.P$7(D) U$27.P$8(D)
V_2A: C44.P$1 JP16.2 JP18.P$1 JP18.P$3 JP18.P$5 LED12.A U$12.P$8(VS) U$24.P$5(D) U$24.P$6(D) U$24.P$7(D) U$24.P$8(D) U$25.P$5(D) U$25.P$6(D) U$25.P$7(D) U$25.P$8(D)
V_3A: C47.2 C50.P$1 JP18.P$11 JP18.P$13 LED15.A U17.7(VIN) U$11.P$8(VS) U$22.P$5(D) U$22.P$6(D) U$22.P$7(D) U$22.P$8(D) U$23.P$5(D) U$23.P$6(D) U$23.P$7(D) U$23.P$8(D)
VBATT_1A: C33.+ D8.1 JP2.P$5 JP2.P$6 JP2.P$7 JP2.P$8 LED7.A U$11.P$7(V2) U$12.P$7(V2) U$13.P$7(V2) U$17.P$5(D) U$17.P$6(D) U$17.P$7(D) U$17.P$8(D) U$19.P$5(D) U$19.P$6(D) U$19.P$7(D) U$19.P$8(D) U$21.P$5(D) U$21.P$6(D) U$21.P$7(D) U$21.P$8(D)
VBATT_1B: C28.+ C51.P$1 D9.1 JP1.P$5 JP1.P$6 JP1.P$7 JP1.P$8 JP19.4 JP19.6 JP19.8 JP19.10 JP19.12 LED5.A U$8.P$7(V2) U$10.P$5(D) U$10.P$6(D) U$10.P$7(D) U$10.P$8(D)
VBATT_2A: C32.+ D7.1 JP2.P$9 JP2.P$10 JP2.P$11 JP2.P$12 LED6.A U$11.P$9(V1) U$12.P$9(V1) U$13.P$9(V1) U$16.P$5(D) U$16.P$6(D) U$16.P$7(D) U$16.P$8(D) U$18.P$5(D) U$18.P$6(D) U$18.P$7(D) U$18.P$8(D) U$20.P$5(D) U$20.P$6(D) U$20.P$7(D) U$20.P$8(D)
VBATT_2B: C27.+ C53.P$1 D10.1 JP1.P$9 JP1.P$10 JP1.P$11 JP1.P$12 JP19.14 JP19.16 JP19.18 JP19.20 JP19.22 JP19.24 LED4.A U$8.P$9(V1) U$9.P$5(D) U$9.P$6(D) U$9.P$7(D) U$9.P$8(D)
XTAL1: C37.2 R39.1 U11.7(PB6) U$7.P$1
XTAL2: C38.2 R39.2 U11.8(PB7) U$7.P$3
XTAL3: C5.2 IC1.3(CORE:XTOUT) R2.1 U$2.P$1
XTAL4: C6.2 IC1.2(CORE:XTIN) R2.2 U$2.P$3
XTAL5: C25.2 IC2.3(CORE:XTOUT) R27.1 U$6.P$1
XTAL6: C26.2 IC2.2(CORE:XTIN) R27.2 U$6.P$3
Unconnected: IC1.18(A:DB2/RTS) IC1.19(A:DB3/CTS) IC1.21(A:DB4/DTR) IC1.22(A:DB5/DSR) IC1.23(A:DB6/DCD) IC1.24(A:DB7/RI) IC1.28(B:DB2/RTS) IC1.29(B:DB3/CTS) IC1.30(B:DB4/DTR) IC1.32(B:DB5/DSR) IC1.33(B:DB6/DCD) IC1.34(B:DB7/RI) IC1.36(CORE:SUSPEND#) IC1.40(C:DB2/RTS) IC1.41(C:DB3/CTS) IC1.43(C:DB4/DTR) IC1.44(C:DB5/DSR) IC1.45(C:DB6/DCD) IC1.46(C:DB7/RI) IC1.60(CORE:PWREN#) IC2.18(A:DB2/RTS) IC2.19(A:DB3/CTS) IC2.21(A:DB4/DTR) IC2.22(A:DB5/DSR) IC2.23(A:DB6/DCD) IC2.24(A:DB7/RI) IC2.28(B:DB2/RTS) IC2.29(B:DB3/CTS) IC2.30(B:DB4/DTR) IC2.32(B:DB5/DSR) IC2.33(B:DB6/DCD) IC2.34(B:DB7/RI) IC2.36(CORE:SUSPEND#) IC2.40(C:DB2/RTS) IC2.41(C:DB3/CTS) IC2.43(C:DB4/DTR) IC2.44(C:DB5/DSR) IC2.45(C:DB6/DCD) IC2.46(C:DB7/RI) IC2.53(D:DB2/RTS) IC2.54(D:DB3/CTS) IC2.55(D:DB4/DTR) IC2.57(D:DB5/DSR) IC2.58(D:DB6/DCD) IC2.59(D:DB7/RI) IC2.60(CORE:PWREN#) U2.1(NC) U9.P$6(NC) U10.1(NC) U16.2(NC_2) U16.3(NC) U16.5(ENA) U17.2(NC_2) U17.3(NC) U17.5(ENA) U$1.ID U$1.MTN1(MTN2) U$1.MTN2(MTN3) U$1.MTN3(MTN1) U$1.MTN4 U$5.ID U$5.MTN1(MTN2) U$5.MTN2(MTN3) U$5.MTN3(MTN1) U$5.MTN4 U$8.P$1(H1) U$8.P$5(H2) U$11.P$1(H1) U$11.P$5(H2) U$12.P$1(H1) U$12.P$5(H2) U$13.P$1(H1) U$13.P$5(H2)

## Notes on the sheet
- Things to include
  Adjustable Voltage Regulator 2102646 
  Better MOSFETS 
  reed switch stuff. breakaway
  Interface Isolation btw PMB, PDB and EC
  Caps and Inductors
  Fuse
  FAN - SP402024M-W
  
  Link all thrusters to same batt?

## Library data of the parts
C1-C10 C12-C19 C21-C26 C29-C31 C34-C41 C43 C46-C48 C52 C55-C61 = resistor:C-US: CAPACITOR, American symbol
C11 C20 C42 C44 C45 C49-C51 C53 C54 = ver6:EEEFTH101XAP
C27 C28 C32 C33 = resistor:CPOL-US: POLARIZED CAPACITOR, American symbol
D1-D10 = ver6:MBRM140T3G-1459068RL
F1 F3 = ver5:MF-MSMF050-2
F2 F4 = ver6:0154.500DR-FUSE-0453.500
IC1 IC2 = ftdichip-6:FT4232H: Quad USB UART 5th generation USB to 4-port serial controller
JP1 JP2 JP18 = ver6:39-29-1167-MOLEX
JP3-JP5 JP11-JP14 = pinhead:PINHD-1X3: PIN HEADER
JP6 = pinhead:PINHD-1X6: PIN HEADER
JP7 JP15 JP16 = pinhead:PINHD-1X2: PIN HEADER
JP8 = pinhead:PINHD-1X4: PIN HEADER
JP9 JP10 = pinhead:PINHD-2X3: PIN HEADER
JP17 = ver6:39-29-4049-MOLEX
JP19 = ver6:43045-2400
L1 L2 L5 L6 = ver6:LAIRD-TECH-INDUCTOR-TYS5040
L3 L4 = ver6:SER1360-802KLD-2288814RL-INDUCTOR
LED1-LED15 = led:LED: LED OSRAM: - CHIPLED LG R971, LG N971, LY N971, LG Q971, LY Q971, LO R971, LY R971 LH N974, LH R974 LS Q976, LO Q976, LY Q976 LO Q996 - Hyper CHIPLED LW Q18S LB Q993, LB Q99A, LB R99A - SideLED LS A670, LO A670, LY A670, LG A670, LP A670 LB A673, LV A673, LT A673, LW A673 LH A674 LY A675 LS A676, LA A676, LO A676, LY A676, LW A676 LS A679, LY A679, LG A679 - Hyper Micro SIDELED® LS Y876, LA Y876, LO Y876, LY Y876 LT Y87S - SmartLED LW L88C, LW L88S LB L89C, LB L89S, LG L890 LS L89K, LO L89K, LY L89K LS L896, LA L896, LO L896, LY L896 - TOPLED LS T670, LO T670, LY T670, LG T670, LP T670 LSG T670, LSP T670, LSY T670, LOP T670, LYG T670 LG T671, LOG T671, LSG T671 LB T673, LV T673, LT T673, LW T673 LH T674 LS T676, LA T676, LO T676, LY T676, LB T676, LH T676, LSB T676, LW T676 LB T67C, LV T67C, LT T67C, LS T67K, LO T67K, LY T67K, LW E67C LS E67B, LA E67B, LO E67B, LY E67B, LB E67C, LV E67C, LT E67C LW T67C LS T679, LY T679, LG T679 LS T770, LO T770, LY T770, LG T770, LP T770 LB T773, LV T773, LT T773, LW T773 LH T774 LS E675, LA E675, LY E675, LS T675 LS T776, LA T776, LO T776, LY T776, LB T776 LHGB T686 LT T68C, LB T68C - Hyper Mini TOPLED® LB M676 - Mini TOPLED Santana® LG M470 LS M47K, LO M47K, LY M47K Source: http://www.osram.convergy.de LUXEON: - LUMILED® LXK2-PW12-R00, LXK2-PW12-S00, LXK2-PW14-U00, LXK2-PW14-V00 LXK2-PM12-R00, LXK2-PM12-S00, LXK2-PM14-U00 LXK2-PE12-Q00, LXK2-PE12-R00, LXK2-PE12-S00, LXK2-PE14-T00, LXK2-PE14-U00 LXK2-PB12-K00, LXK2-PB12-L00, LXK2-PB12-M00, LXK2-PB14-N00, LXK2-PB14-P00, LXK2-PB14-Q00 LXK2-PR12-L00, LXK2-PR12-M00, LXK2-PR14-Q00, LXK2-PR14-R00 LXK2-PD12-Q00, LXK2-PD12-R00, LXK2-PD12-S00 LXK2-PH12-R00, LXK2-PH12-S00 LXK2-PL12-P00, LXK2-PL12-Q00, LXK2-PL12-R00 Source: www.luxeon.com KINGBRIGHT: KA-3528ASYC Source: www.kingbright.com
R1-R70 = resistor:R-EU_: RESISTOR, European symbol
SW1-SW3 = ver5:MC32829
U1 U8 = ver6:ADUM3160BRWZ: Full/Low Speed 2.5 kV USB Digital Isolator; MPN: ADUM3160BRWZ; OC_FARNELL: 1843660; OC_NEWARK: 85R6420; PACKAGE: SOIC-16; SUPPLIER: Analog Devices
U2 U10 = ver5-smd-ipc:CAT93C46WI-GT3-1718152-EEPROM
U3 U18 = ver6:LT3509EMSEPBF: Dual 36V, 700mA Step-Down Regulator; MPN: LT3509EMSE#PBF; OC_FARNELL: 2102646; OC_NEWARK: 44P2426; PACKAGE: MSOP-16; SUPPLIER: Linear Technology
U4-U6 U12-U15 = ver5-smd-ipc:TI-ISO7221
U7 = ver6:PS2701A-1-F3-A-1682859RL
U9 = ver5:MPL115A2-OR-MPL115A2T1
U11 = Atmel_By_element14_Batch_1:ATMEGA328P-AU: 8-bit Microcontroller with In-System Programmable Flash; MPN: ATMEGA328P-AU; OC_FARNELL: 1715486; OC_NEWARK: 14R4631; PACKAGE: TQFP-32; SUPPLIER: Atmel
U16 U17 = ver6:TPS5450DDARG4: STEP-DOWN SWIFT CONVERTER; MPN: TPS5450DDARG4; OC_FARNELL: 1703401; OC_NEWARK: 59M7214; PACKAGE: SOIC-8; SUPPLIER: Texas Instruments
U$1 U$5 = SparkFun-Connectors:USB-MINIB: Mini-USB "B" connector with 5th pin broken out. Created new symbol breaking out 5th "ID" pin in mini/micro USB connector spec. See: http://en.wikipedia.org/wiki/Mini_usb#Cables. Uses same footprint as 4-pin symbol. Also added pins to connect to mounting / shield pads if required (probably not generally needed as signals aren't shielded once they leave the connector).
U$2 U$6 U$7 = ver6:ABMM2-16.000MHZ-E2-T
U$8 U$11-U$13 = ver6:LTC4416
U$9 U$10 U$14-U$27 = ver6:IRF9310PBF

## Net classes
0 default: clearance 0.152 mm